# EAGLE design main (EAGLE 8.6.0)

## Sheet 1 of 7
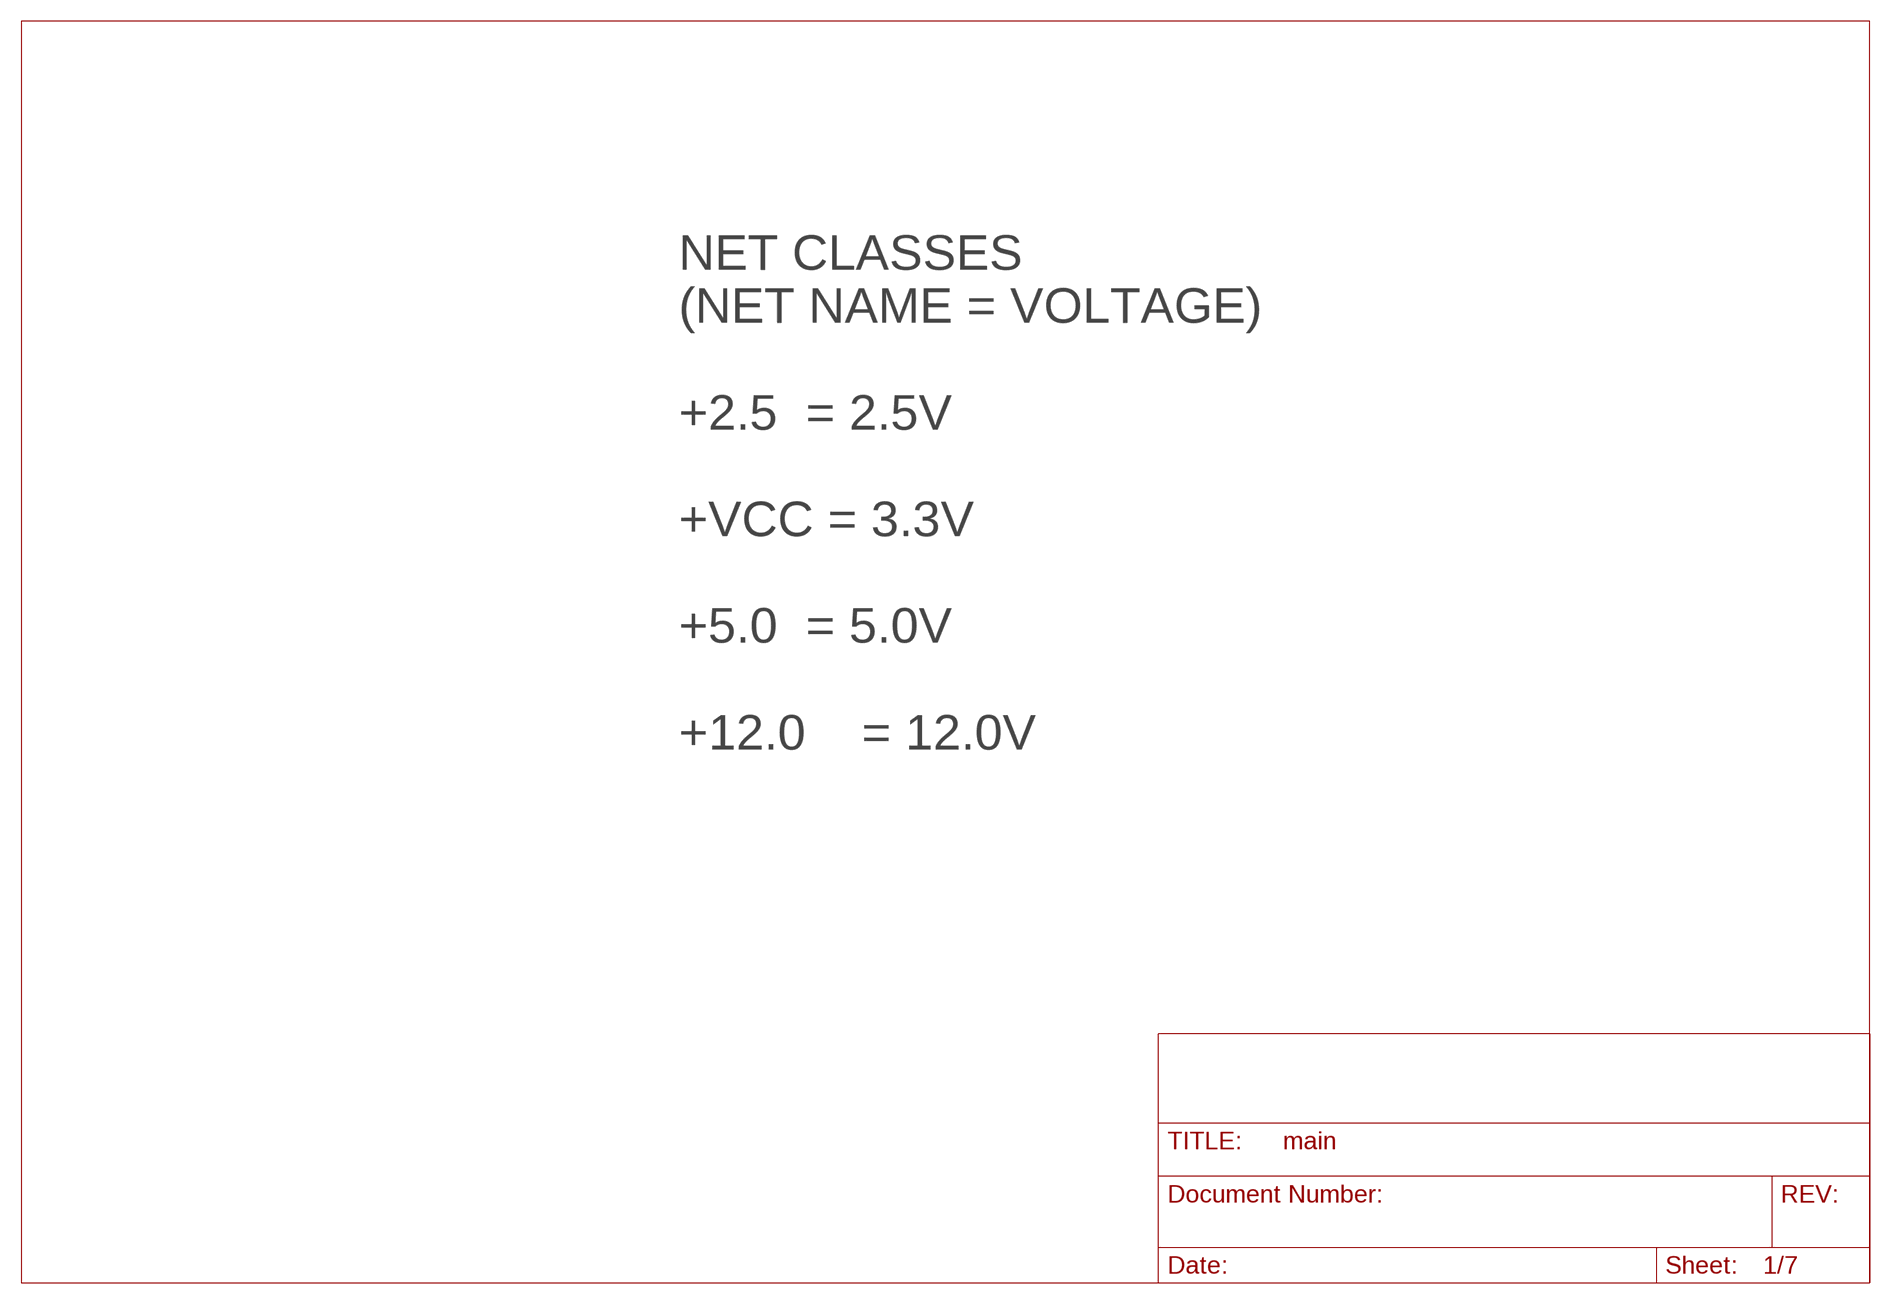
[diagram p0: schematic, sheet 1]

### Notes on the sheet
- NET CLASSES
  (NET NAME = VOLTAGE)
  
  +2.5  = 2.5V
  
  +VCC = 3.3V
  
  +5.0  = 5.0V
  
  +12.0    = 12.0V

## Sheet 2 of 7: MCU
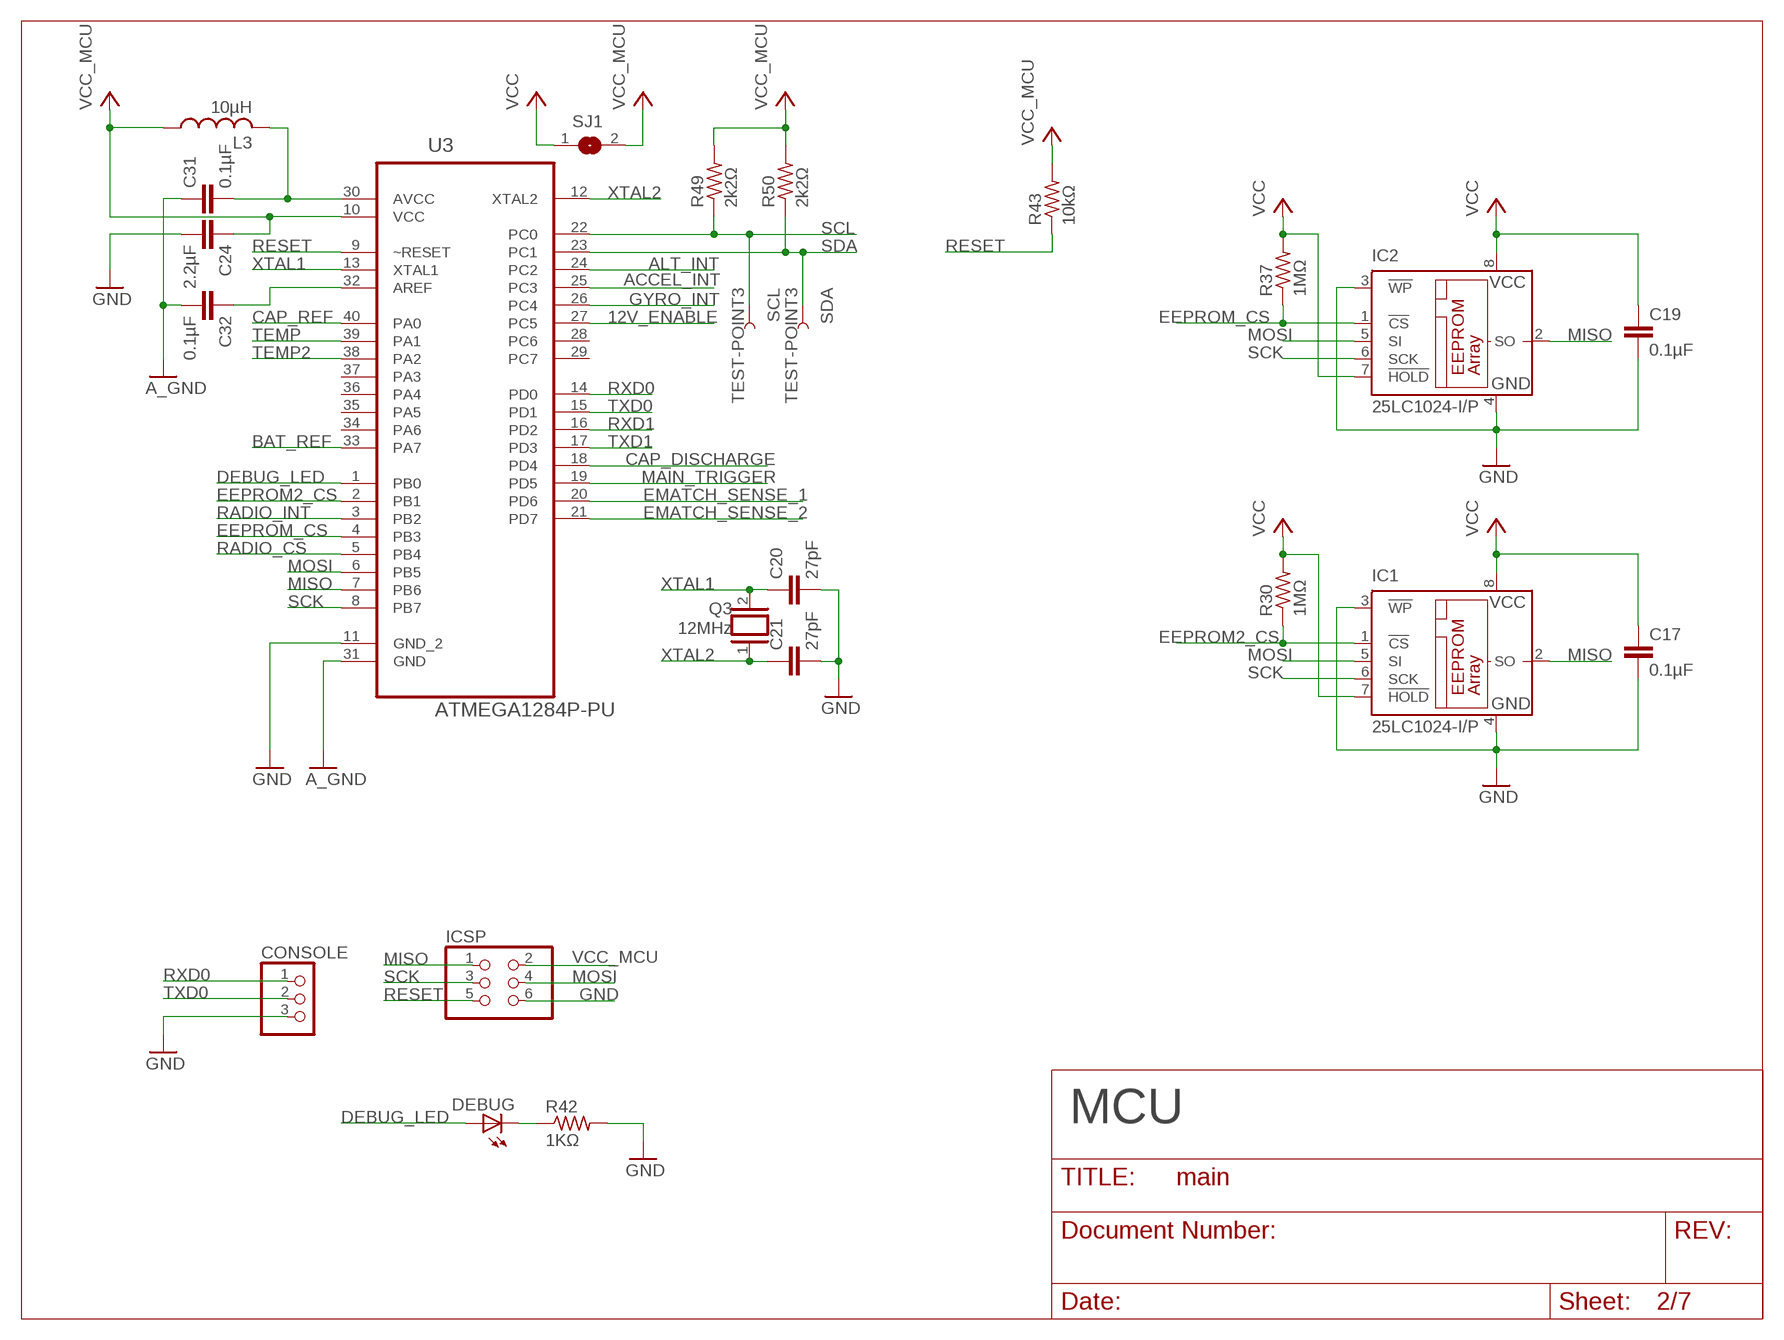
[diagram p1: schematic, sheet 2]

### Parts
C17  0.1µF  C-EU025-025X050  [C025-025X050]
C19  0.1µF  C-EU025-025X050  [C025-025X050]
C20  27pF  C-EU025-025X050  [C025-025X050]
C21  27pF  C-EU025-025X050  [C025-025X050]
C24  2.2µF  C-EU025-025X050  [C025-025X050]
C31  0.1µF  C-EU025-025X050  [C025-025X050]
C32  0.1µF  C-EU025-025X050  [C025-025X050]
CONSOLE  PINHD-1X3  [1X03]
DEBUG  LED5MM  [LED5MM]
IC1  25LC1024-I/P  25LC080P  [DIL8]
IC2  25LC1024-I/P  25LC080P  [DIL8]
ICSP  PINHD-2X3  [2X03]
L3  10µH  L-US0207/5V  [0207/5V]
Q3  12MHz  XTAL/S  [QS]
R30  1MΩ  R-US_0207/5V  [0207/5V]
R37  1MΩ  R-US_0207/5V  [0207/5V]
R42  1KΩ  R-US_0207/5V  [0207/5V]
R43  10kΩ  R-US_0207/5V  [0207/5V]
R49  2k2Ω  R-US_0207/5V  [0207/5V]
R50  2k2Ω  R-US_0207/5V  [0207/5V]
SCL  TEST-POINT3  [PAD.03X.03]
SDA  TEST-POINT3  [PAD.03X.03]
SJ1  SJ  [SJ]
U3  ATMEGA1284P-PU  [DIP254P1524X483-40]

### Nets
12V_ENABLE: U3.27(PC5) ; also sheet 5,7
A_GND: C31.1 C32.2 U3.31(GND) ; also sheet 3,7
ACCEL_INT: U3.25(PC3) ; also sheet 3
ALT_INT: U3.24(PC2) ; also sheet 3
AREF: C32.1 U3.32(AREF)
AVCC: C31.2 L3.2 U3.30(AVCC) ; also sheet 3
BAT_REF: U3.33(PA7) ; also sheet 3
CAP_DISCHARGE: U3.18(PD4) ; also sheet 7
CAP_REF: U3.40(PA0) ; also sheet 7
DEBUG_LED: DEBUG.A U3.1(PB0)
EEPROM2_CS: IC1.1(!CS) R30.1 U3.2(PB1)
EEPROM_CS: IC2.1(!CS) R37.1 U3.4(PB3)
EMATCH_SENSE_1: U3.20(PD6) ; also sheet 7
EMATCH_SENSE_2: U3.21(PD7) ; also sheet 7
GND: C17.2 C19.2 C20.2 C21.2 C24.2 CONSOLE.3 IC1.3(!WP) IC1.4(GND) IC2.3(!WP) IC2.4(GND) ICSP.6 R42.2 U3.11(GND_2) ; also sheet 3,4,5,6,7
GYRO_INT: U3.26(PC4) ; also sheet 3
MAIN_TRIGGER: U3.19(PD5) ; also sheet 7
MISO: IC1.2(SO) IC2.2(SO) ICSP.1 U3.7(PB6) ; also sheet 4
MOSI: IC1.5(SI) IC2.5(SI) ICSP.4 U3.6(PB5) ; also sheet 4
N$71: DEBUG.K(C) R42.1
RADIO_CS: U3.5(PB4) ; also sheet 4
RADIO_INT: U3.3(PB2) ; also sheet 4
RESET: ICSP.5 R43.1 U3.9(~RESET)
RXD0: CONSOLE.1 U3.14(PD0)
RXD1: U3.16(PD2) ; also sheet 3
SCK: IC1.6(SCK) IC2.6(SCK) ICSP.3 U3.8(PB7) ; also sheet 4
SCL: R49.1 SCL.P$1 U3.22(PC0) ; also sheet 3
SDA: R50.1 SDA.P$1 U3.23(PC1) ; also sheet 3
TEMP: U3.39(PA1) ; also sheet 3
TEMP2: U3.38(PA2) ; also sheet 3
TXD0: CONSOLE.2 U3.15(PD1)
TXD1: U3.17(PD3) ; also sheet 3
VCC: C17.1 C19.1 IC1.7(!HOLD) IC1.8(VCC) IC2.7(!HOLD) IC2.8(VCC) R30.2 R37.2 SJ1.1 ; also sheet 3,4,5
VCC_MCU: C24.1 ICSP.2 L3.1 R43.2 R49.2 R50.2 SJ1.2 U3.10(VCC) ; also sheet 4
XTAL1: C20.1 Q3.2 U3.13(XTAL1)
XTAL2: C21.1 Q3.1 U3.12(XTAL2)
Unconnected: U3.28(PC6) U3.29(PC7) U3.34(PA6) U3.35(PA5) U3.36(PA4) U3.37(PA3)

### Notes on the sheet
- MCU

## Sheet 3 of 7: SENSORS
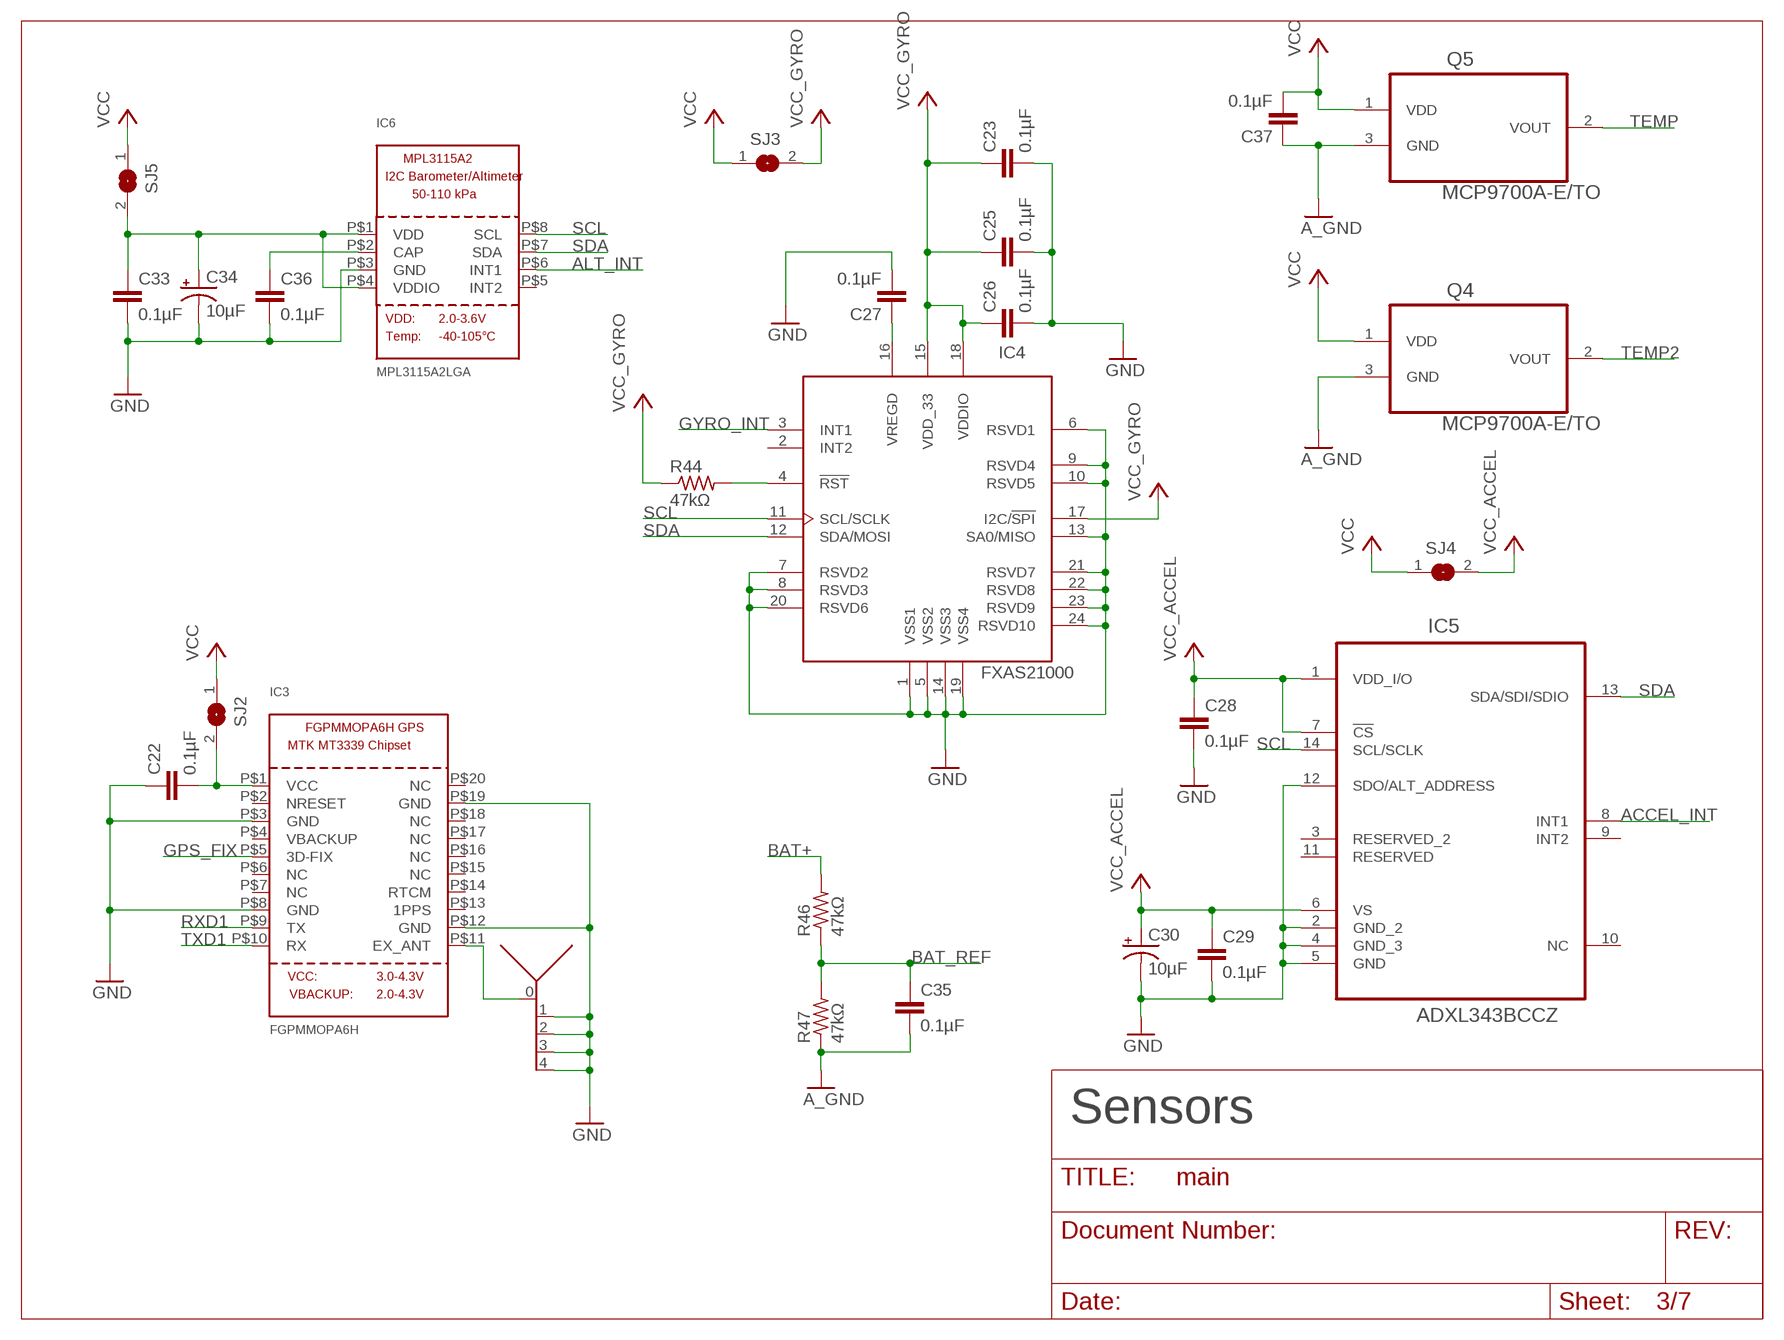
[diagram p2: schematic, sheet 3]

### Parts
C22  0.1µF  C-EU025-025X050  [C025-025X050]
C23  0.1µF  C-EU025-025X050  [C025-025X050]
C25  0.1µF  C-EU025-025X050  [C025-025X050]
C26  0.1µF  C-EU025-025X050  [C025-025X050]
C27  0.1µF  C-EU025-025X050  [C025-025X050]
C28  0.1µF  C-EU025-025X050  [C025-025X050]
C29  0.1µF  C-EU025-025X050  [C025-025X050]
C30  10µF  CPOL-USE2-5  [E2-5]
C33  0.1µF  C-EU025-025X050  [C025-025X050]
C34  10µF  CPOL-USE2-5  [E2-5]
C35  0.1µF  C-EU025-025X050  [C025-025X050]
C36  0.1µF  C-EU025-025X050  [C025-025X050]
C37  0.1µF  C-EU025-025X050  [C025-025X050]
IC3  FGPMMOPA6H  GPS_FGPMMOPA6H  [FGPMMOPA6H]
IC4  FXAS21000  [QFN24_0P5_4X4_ASYM_EXP]
IC5  ADXL343BCCZ  [LGA14R80P1X6_300X500X100]
IC6  MPL3115A2LGA  [LGA8]
Q4  MCP9700A-E/TO  [TO127P254X533-3]
Q5  MCP9700A-E/TO  [TO127P254X533-3]
R44  47kΩ  R-US_0207/5V  [0207/5V]
R46  47kΩ  R-US_0207/5V  [0207/5V]
R47  47kΩ  R-US_0207/5V  [0207/5V]
SJ2  SJ  [SJ]
SJ3  SJ  [SJ]
SJ4  SJ  [SJ]
SJ5  SJ  [SJ]
X1  132134RP  [132134RP]

### Nets
A_GND: C35.2 C37.1 Q4.3(GND) Q5.3(GND) R47.1 ; also sheet 2,7
ACCEL_INT: IC5.8(INT1) ; also sheet 2
ALT_INT: IC6.P$6(INT1) ; also sheet 2
AVCC: C37.2 Q4.1(VDD) Q5.1(VDD) ; supply symbol labelled VCC ; also sheet 2
BAT+: R46.2 ; also sheet 6
BAT_REF: C35.1 R46.1 R47.2 ; also sheet 2
GND: C22.1 C23.2 C25.2 C26.2 C27.2 C28.2 C29.2 C30.- C33.2 C34.- C36.2 IC3.P$3(GND) IC3.P$8(GND) IC3.P$12(GND) IC3.P$19(GND) IC4.1(VSS1) IC4.5(VSS2) IC4.6(RSVD1) IC4.7(RSVD2) IC4.8(RSVD3) IC4.9(RSVD4) IC4.10(RSVD5) IC4.13(SA0/MISO) IC4.14(VSS3) IC4.19(VSS4) IC4.20(RSVD6) IC4.21(RSVD7) IC4.22(RSVD8) IC4.23(RSVD9) IC4.24(RSVD10) IC5.2(GND_2) IC5.4(GND_3) IC5.5(GND) IC5.12(SDO/ALT_ADDRESS) IC6.P$3(GND) X1.1(GND) X1.2(GND) X1.3(GND) X1.4(GND) ; also sheet 2,4,5,6,7
GPS_FIX: IC3.P$5(3D-FIX)
GYRO_INT: IC4.3(INT1) ; also sheet 2
N$1: C27.1 IC4.16(VREGD)
N$2: IC4.4(!RST) R44.2
N$3: C36.1 IC6.P$2(CAP)
N$4: IC3.P$11(EX_ANT) X1.0(ANTENNA)
RXD1: IC3.P$9(TX) ; also sheet 2
SCL: IC4.11(SCL/SCLK) IC5.14(SCL/SCLK) IC6.P$8(SCL) ; also sheet 2
SDA: IC4.12(SDA/MOSI) IC5.13(SDA/SDI/SDIO) IC6.P$7(SDA) ; also sheet 2
TEMP: Q5.2(VOUT) ; also sheet 2
TEMP2: Q4.2(VOUT) ; also sheet 2
TXD1: IC3.P$10(RX) ; also sheet 2
VCC: SJ2.1 SJ3.1 SJ4.1 SJ5.1 ; also sheet 2,4,5
VCC_ACCEL: C28.1 C29.1 C30.+ IC5.1(VDD_I/O) IC5.6(VS) IC5.7(!CS) SJ4.2
VCC_ALT: C33.1 C34.+ IC6.P$1(VDD) IC6.P$4(VDDIO) SJ5.2
VCC_GPS: C22.2 IC3.P$1(VCC) SJ2.2
VCC_GYRO: C23.1 C25.1 C26.1 IC4.15(VDD_33) IC4.17(I2C/!SPI) IC4.18(VDDIO) R44.1 SJ3.2
Unconnected: IC3.P$2(NRESET) IC3.P$4(VBACKUP) IC3.P$6(NC) IC3.P$7(NC) IC3.P$13(1PPS) IC3.P$14(RTCM) IC3.P$15(NC) IC3.P$16(NC) IC3.P$17(NC) IC3.P$18(NC) IC3.P$20(NC) IC4.2(INT2) IC5.3(RESERVED_2) IC5.9(INT2) IC5.10(NC) IC5.11(RESERVED) IC6.P$5(INT2)

### Notes on the sheet
- Sensors

## Sheet 4 of 7: RADIO
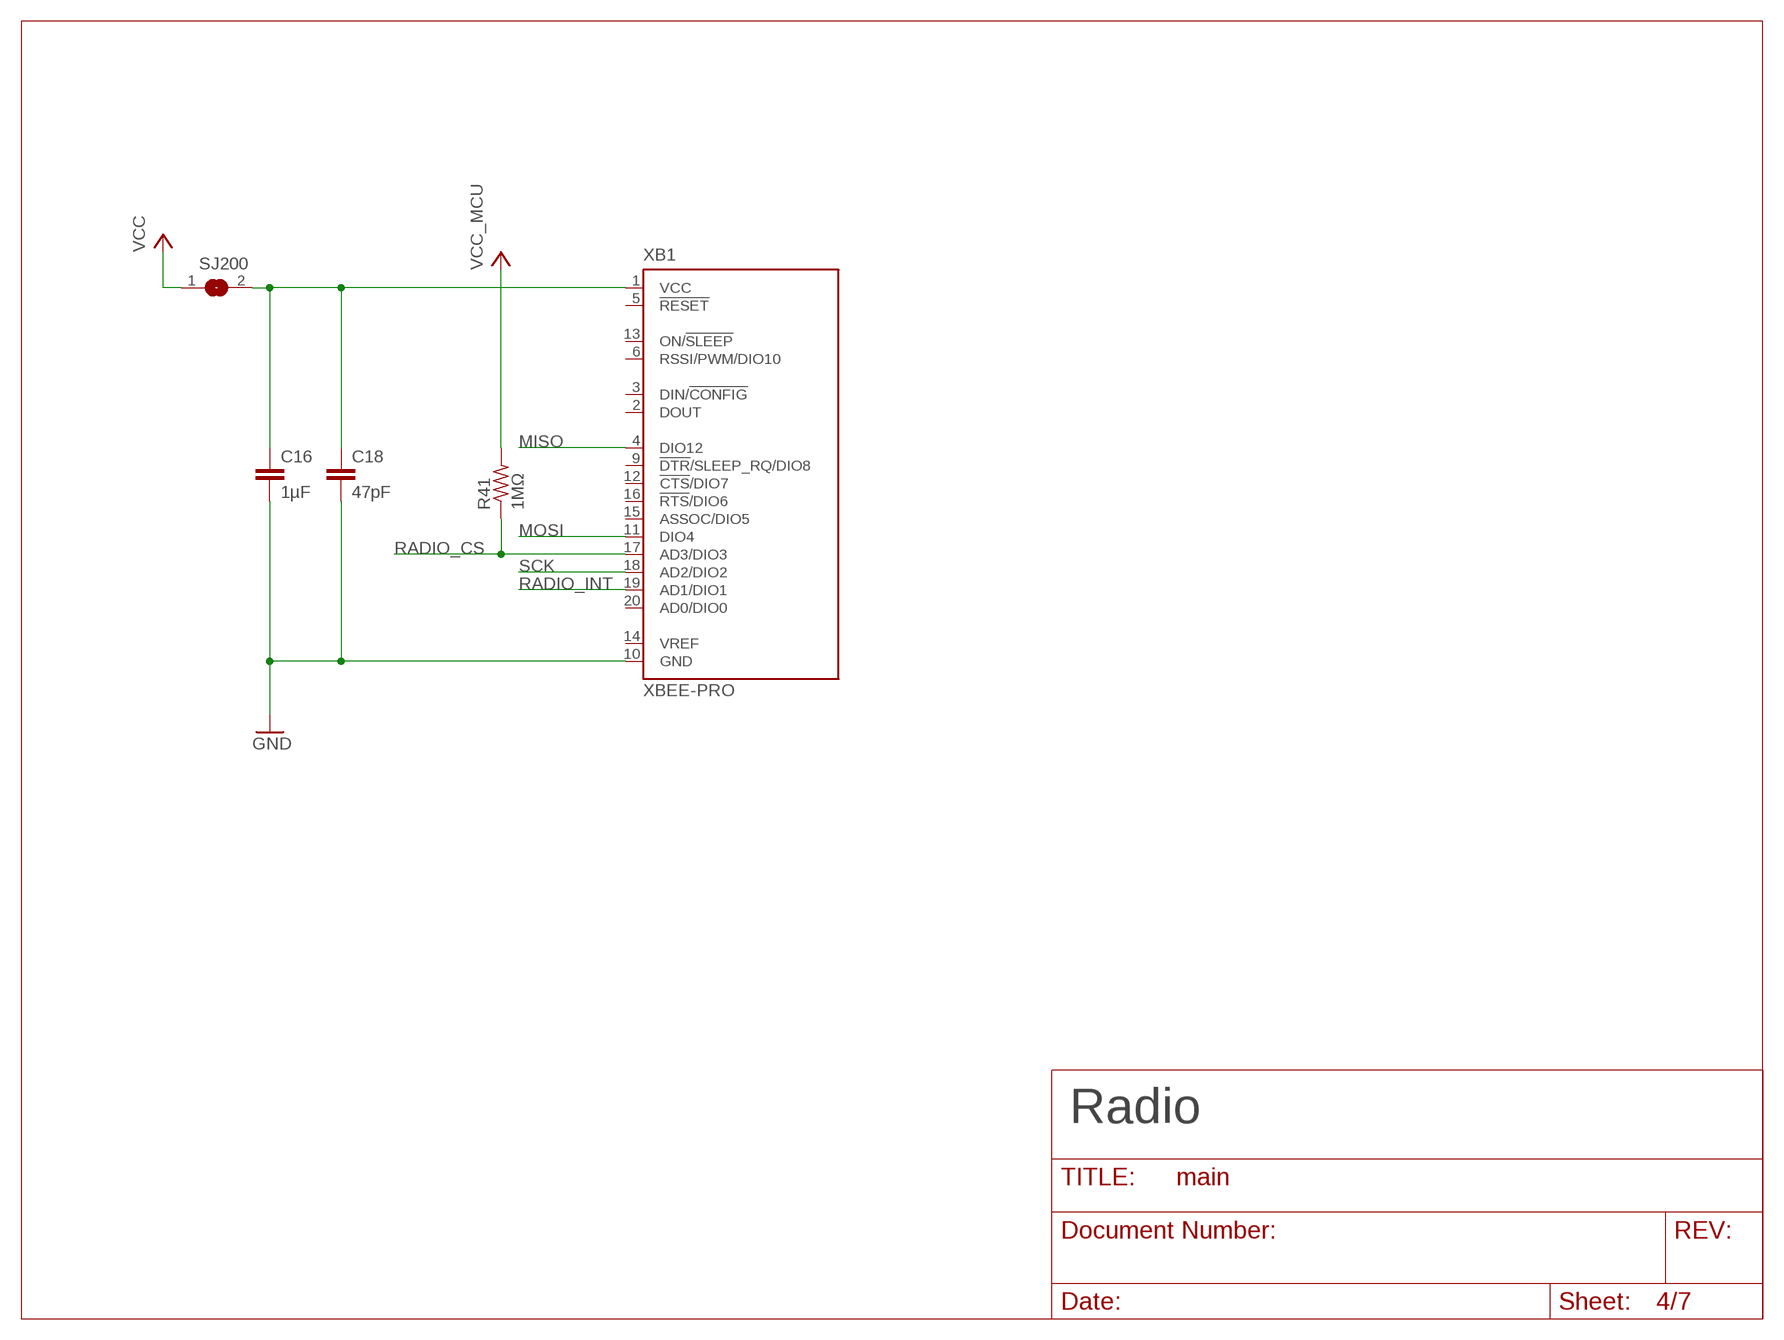
[diagram p3: schematic, sheet 4]

### Parts
C16  1µF  C-EU025-025X050  [C025-025X050]
C18  47pF  C-EU025-025X050  [C025-025X050]
R41  1MΩ  R-US_0207/5V  [0207/5V]
SJ200  SJ  [SJ]
XB1  XBEE-PRO  [XBEE-PRO]

### Nets
GND: C16.2 C18.2 XB1.10(GND) ; also sheet 2,3,5,6,7
MISO: XB1.4(DIO12) ; also sheet 2
MOSI: XB1.11(DIO4) ; also sheet 2
RADIO_CS: R41.1 XB1.17(AD3/DIO3) ; also sheet 2
RADIO_INT: XB1.19(AD1/DIO1) ; also sheet 2
SCK: XB1.18(AD2/DIO2) ; also sheet 2
VCC: SJ200.1 ; also sheet 2,3,5
VCC_MCU: R41.2 ; also sheet 2
VCC_XB: C16.1 C18.1 SJ200.2 XB1.1(VCC)
Unconnected: XB1.2(DOUT) XB1.3(DIN/!CONFIG) XB1.5(!RESET) XB1.6(RSSI/PWM/DIO10) XB1.9(!DTR!/SLEEP_RQ/DIO8) XB1.12(!CTS!/DIO7) XB1.13(ON/!SLEEP) XB1.14(VREF) XB1.15(ASSOC/DIO5) XB1.16(!RTS!/DIO6) XB1.20(AD0/DIO0)

### Notes on the sheet
- Radio

## Sheet 5 of 7: Power Regulatror
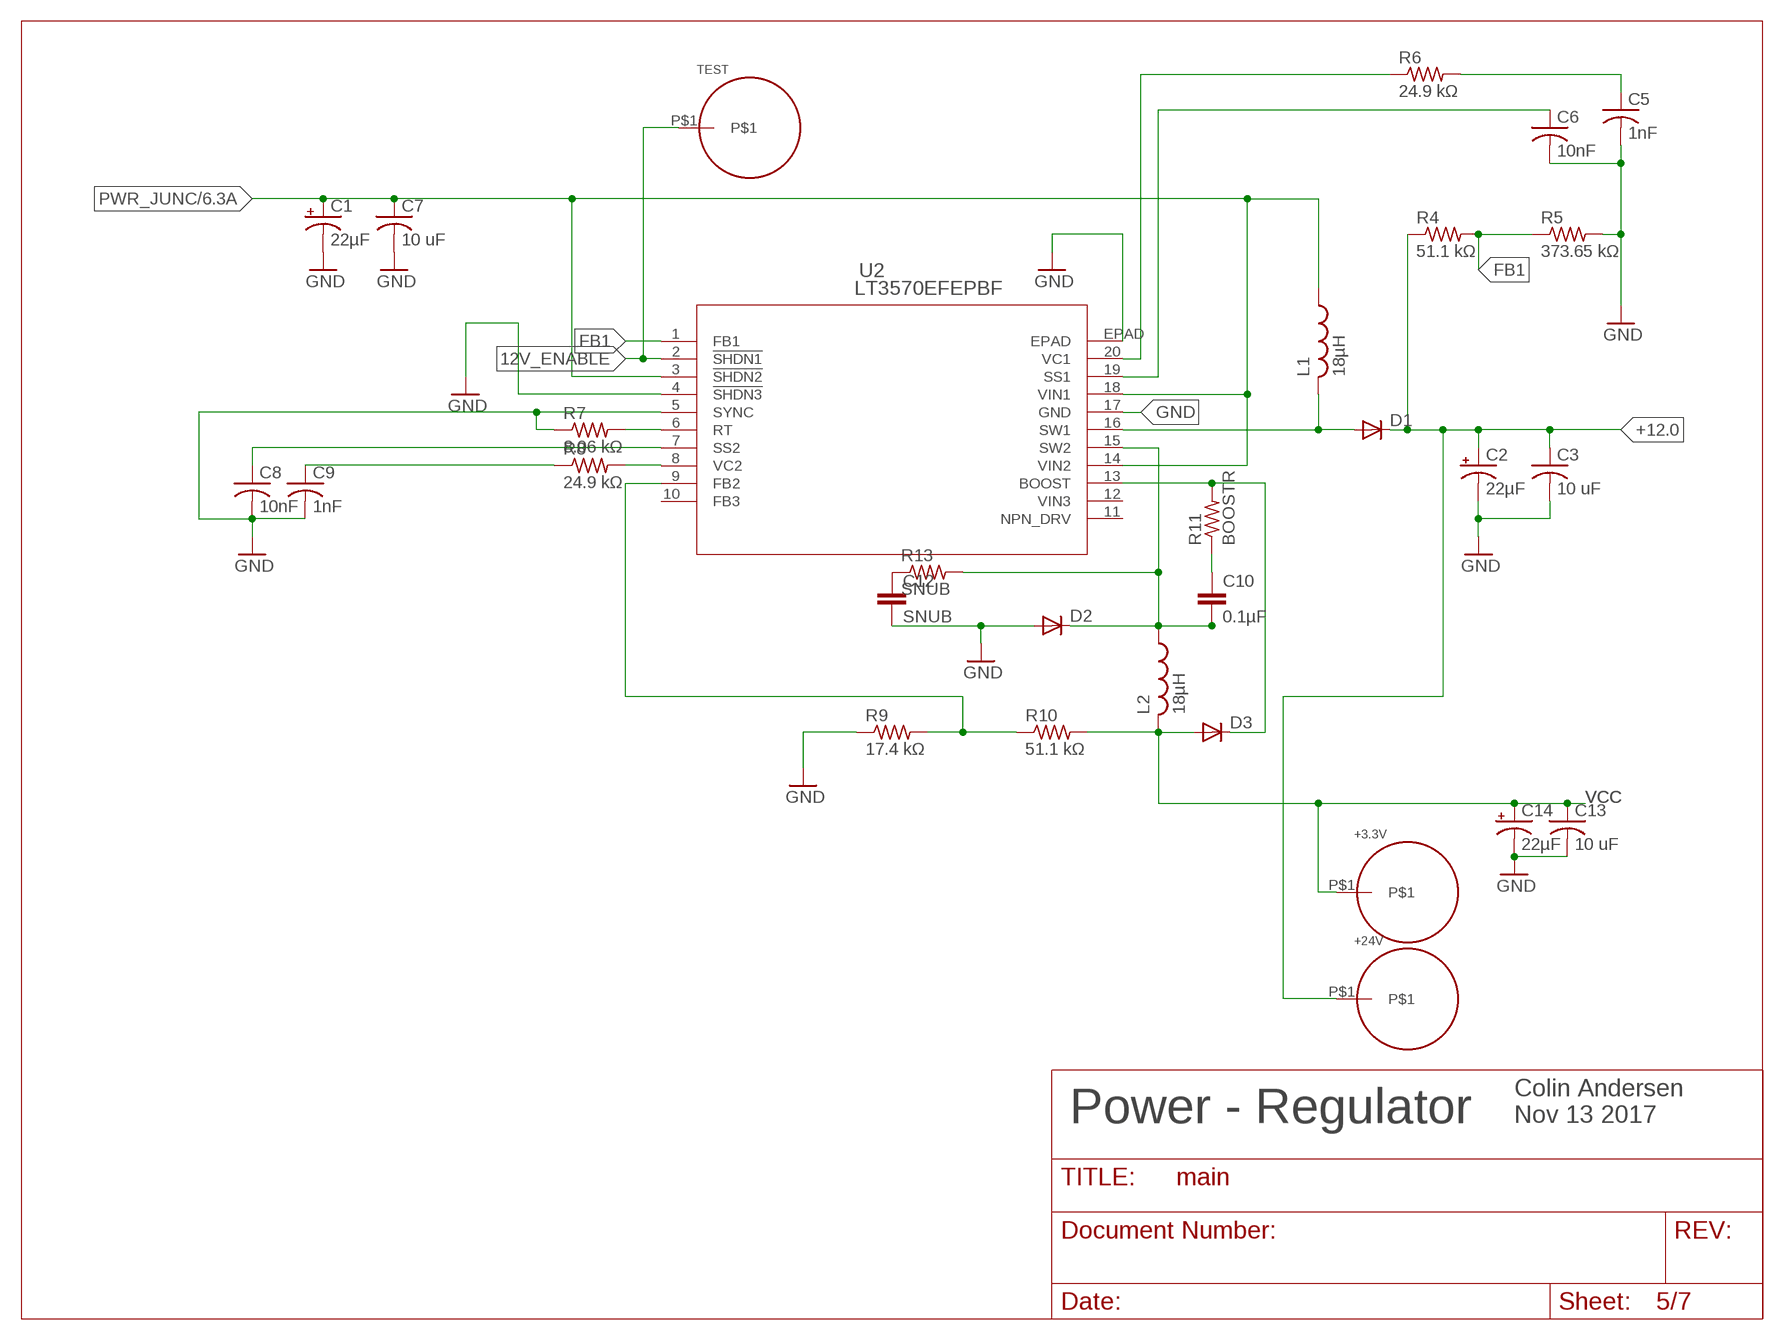
[diagram p4: schematic, sheet 5]

### Parts
C1  22µF  UST1V220MDD  [2.5MM_AL_CAP]
C2  22µF  UST1V220MDD  [2.5MM_AL_CAP]
C3  10 uF  K102K15X7RF5TL2  [2.5MM_CAP]
C5  1nF  K102K15X7RF5TL2  [2.5MM_CAP]
C6  10nF  K103K15X7RF5TL2  [2.5MM_CAP]
C7  10 uF  K102K15X7RF5TL2  [2.5MM_CAP]
C8  10nF  K103K15X7RF5TL2  [2.5MM_CAP]
C9  1nF  K102K15X7RF5TL2  [2.5MM_CAP]
C10  0.1µF  C-EU025-025X050  [C025-025X050]
C12  SNUB  C-EU025-025X050  [C025-025X050]
C13  10 uF  K102K15X7RF5TL2  [2.5MM_CAP]
C14  22µF  UST1V220MDD  [2.5MM_AL_CAP]
D1  SB230TA  [11.6MM_D]
D2  SB230TA  [11.6MM_D]
D3  SB230TA  [11.6MM_D]
L1  18µH  RLB0914-180KL  [5.4MM_L]
L2  18µH  RLB0914-180KL  [5.4MM_L]
R4  51.1 kΩ  R-US_0207/5V  [0207/5V]
R5  373.65 kΩ  R-US_0207/5V  [0207/5V]
R6  24.9 kΩ  R-US_0207/5V  [0207/5V]
R7  8.06 kΩ  R-US_0207/5V  [0207/5V]
R8  24.9 kΩ  R-US_0207/5V  [0207/5V]
R9  17.4 kΩ  R-US_0207/5V  [0207/5V]
R10  51.1 kΩ  R-US_0207/5V  [0207/5V]
R11  BOOSTR  R-US_0207/5V  [0207/5V]
R13  SNUB  R-US_0207/5V  [0207/5V]
U2  LT3570EFEPBF  [TSSOP-20_FE/CB]
U$2  +24V  TEST  [TEST]
U$3  +3.3V  TEST  [TEST]
U$5  TEST  [TEST]

### Nets
12V_ENABLE: U2.2(!SHDN1) U$5.P$1 ; also sheet 2,7
+12.0: C2.1(+) C3.1 D1.1(C) R4.1 U$2.P$1 ; also sheet 7
FB1: R4.2 R5.1 U2.1(FB1)
GND: C1.2(-) C2.2(-) C3.2 C5.2 C6.2 C7.2 C8.2 C9.2 C12.2 C13.2 C14.2(-) D2.2(A) R5.2 R7.1 R9.1 U2.4(!SHDN3) U2.5(SYNC) U2.17(GND) U2.EPAD ; also sheet 2,3,4,6,7
N$5: C8.1 U2.7(SS2)
N$6: R7.2 U2.6(RT)
N$7: R8.2 U2.8(VC2)
N$8: D1.2(A) L1.2 U2.16(SW1)
N$9: C5.1 R6.2
N$10: C9.1 R8.1
N$11: R6.1 U2.20(VC1)
N$12: C6.1 U2.19(SS1)
N$13: C10.2 D2.1(C) L2.1 R13.2 U2.15(SW2)
N$15: R9.2 R10.1 U2.9(FB2)
N$16: D3.1(C) R11.2 U2.13(BOOST)
N$67: C12.1 R13.1
N$75: C10.1 R11.1
PWR_JUNC: C1.1(+) C7.1 L1.1 U2.3(!SHDN2) U2.14(VIN2) U2.18(VIN1) ; also sheet 6
VCC: C13.1 C14.1(+) D3.2(A) L2.2 R10.2 U$3.P$1 ; also sheet 2,3,4
Unconnected: U2.10(FB3) U2.11(NPN_DRV) U2.12(VIN3)

### Notes on the sheet
- Power - Regulator
- Colin Andersen
  Nov 13 2017

## Sheet 6 of 7: Battery Voltage cutoff circuit
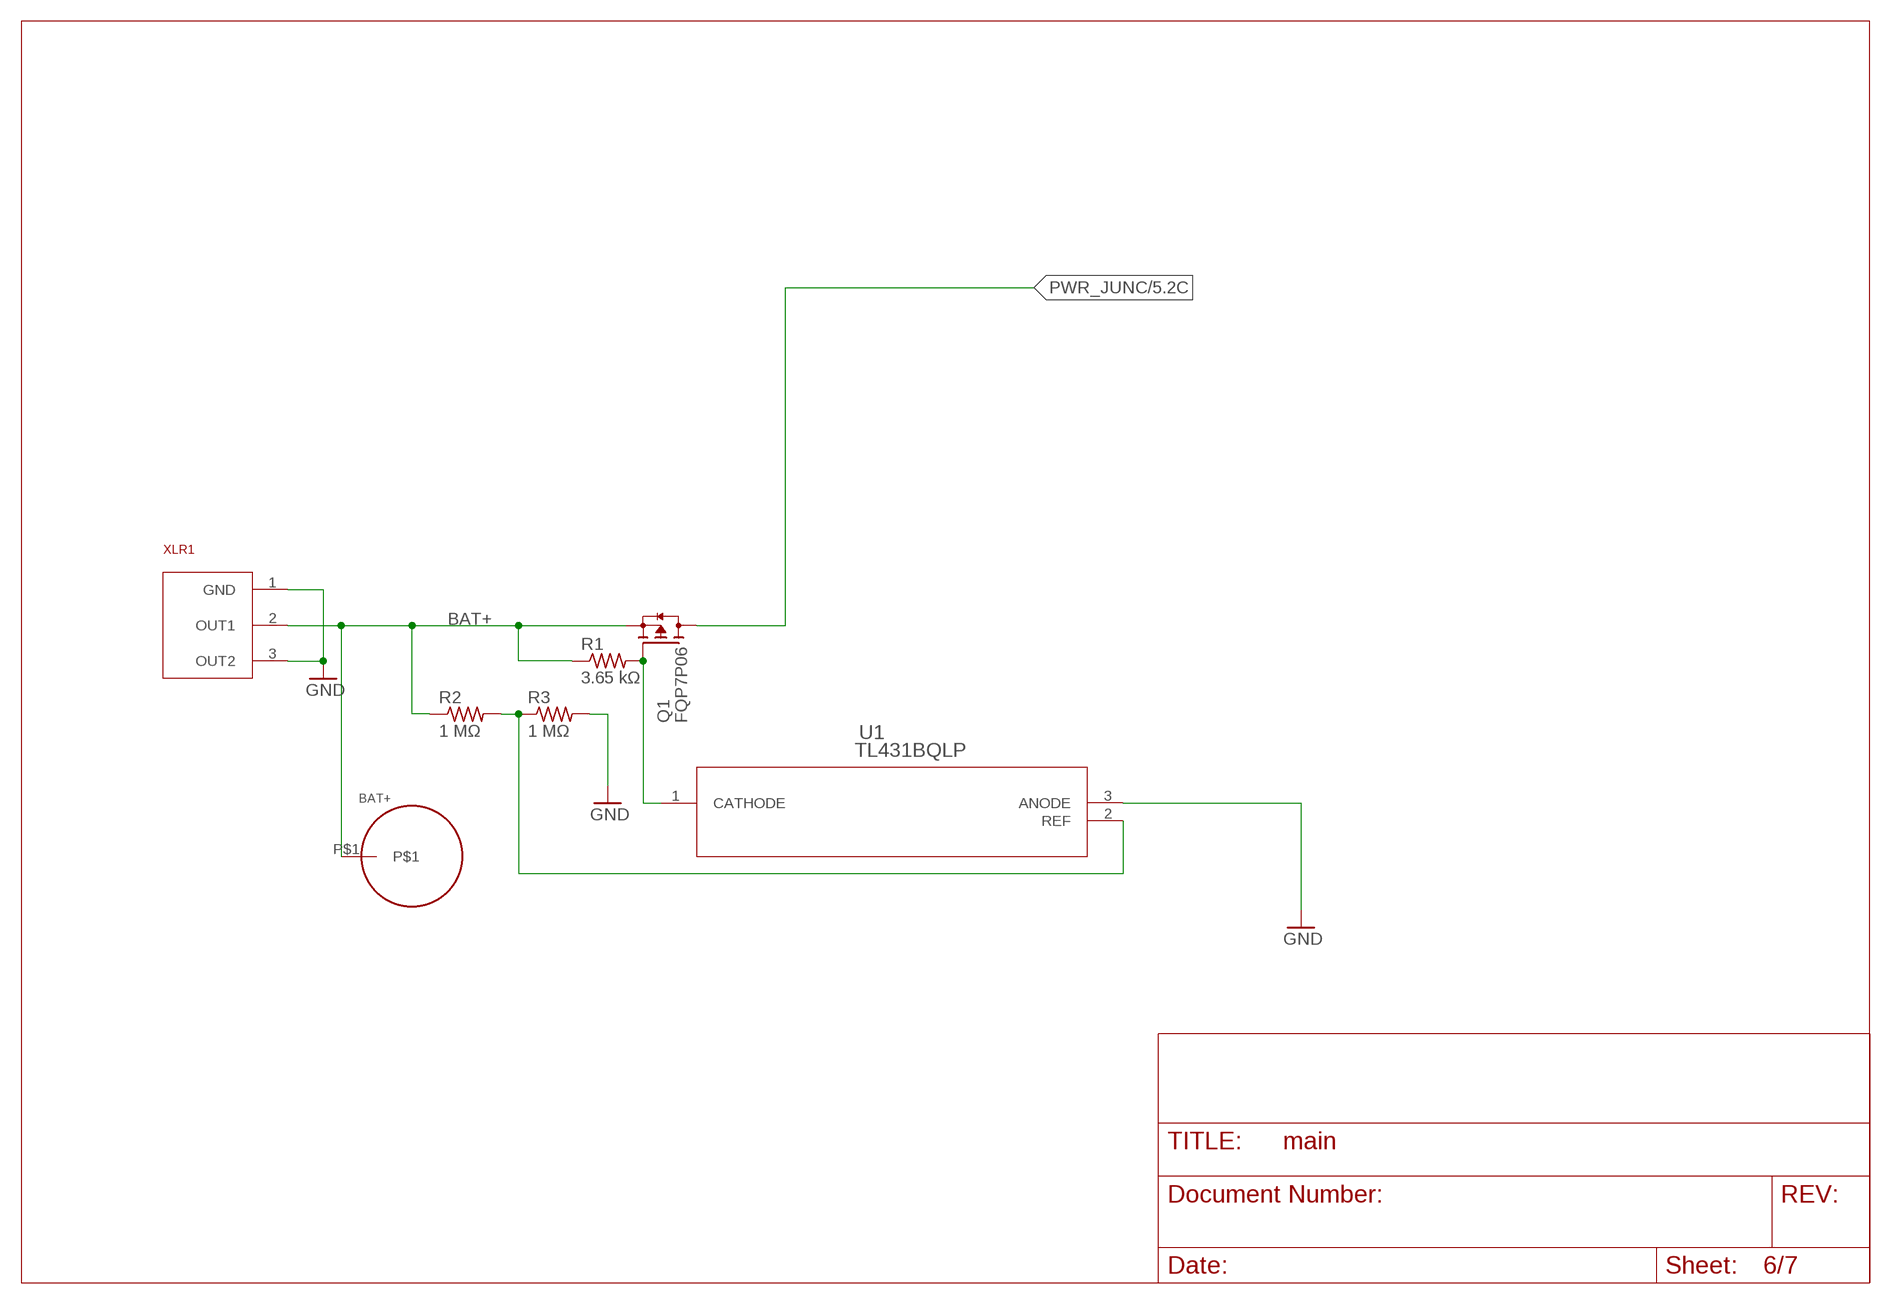
[diagram p5: schematic, sheet 6]

### Parts
Q1  FQP7P06  [PMOS]
R1  3.65 kΩ  R-US_0207/5V  [0207/5V]
R2  1 MΩ  R-US_0207/5V  [0207/5V]
R3  1 MΩ  R-US_0207/5V  [0207/5V]
U1  TL431BQLP  [LP3]
U$1  BAT+  TEST  [TEST]
XLR1  NC3FAH1  [NC3FAH1]

### Nets
BAT+: Q1.3(S) R1.1 R2.1 U$1.P$1 XLR1.2(OUT1) ; also sheet 3
GND: R3.2 U1.3(ANODE) XLR1.1(GND) XLR1.3(OUT2) ; also sheet 2,3,4,5,7
N$69: Q1.1(G) R1.2 U1.1(CATHODE)
N$70: R2.2 R3.1 U1.2(REF)
PWR_JUNC: Q1.2(D) ; also sheet 5

## Sheet 7 of 7: Capictor bank and key switch
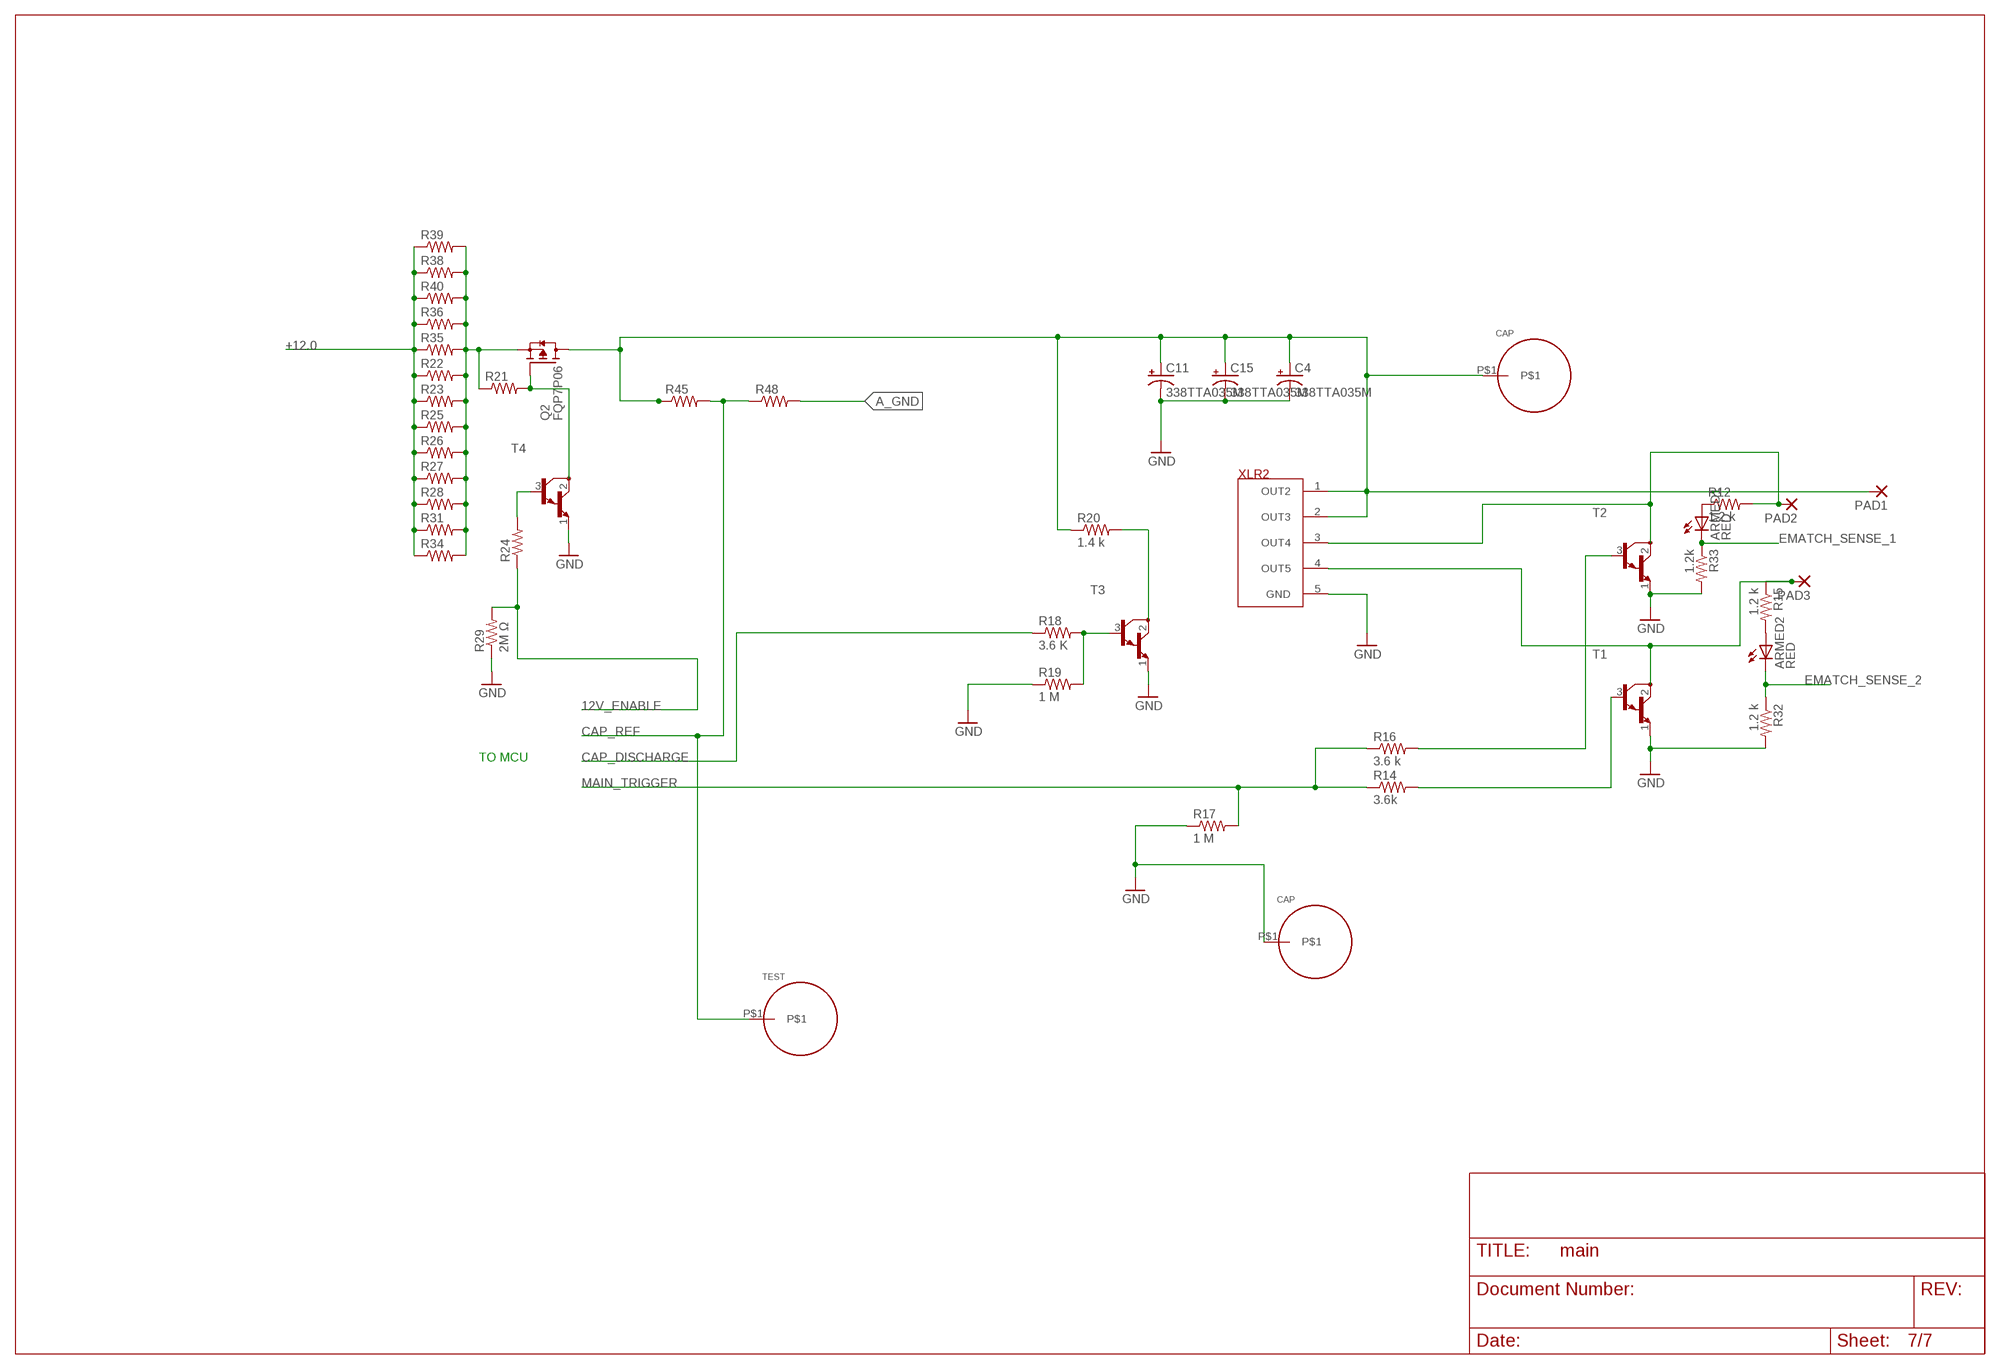
[diagram p6: schematic, sheet 7]

### Parts
ARMED1  RED  LED5MM  [LED5MM]
ARMED2  RED  LED5MM  [LED5MM]
C4  338TTA035M  [338TTA035M]
C11  338TTA035M  [338TTA035M]
C15  338TTA035M  [338TTA035M]
PAD1  CRIMP  [3,81/1,4]
PAD2  CRIMP  [3,81/1,4]
PAD3  CRIMP  [3,81/1,4]
Q2  FQP7P06  [PMOS]
R12  1.2 k  R-US_0207/5V  [0207/5V]
R14  3.6k  R-US_0207/5V  [0207/5V]
R15  1.2 k  R-US_0207/5V  [0207/5V]
R16  3.6 k  R-US_0207/5V  [0207/5V]
R17  1 M  R-US_0207/5V  [0207/5V]
R18  3.6 K  R-US_0207/5V  [0207/5V]
R19  1 M  R-US_0207/5V  [0207/5V]
R20  1.4 k  R-US_0207/5V  [0207/5V]
R21  R-US_0207/5V  [0207/5V]
R22  R-US_0207/5V  [0207/5V]
R23  R-US_0207/5V  [0207/5V]
R24  R-US_0207/5V  [0207/5V]
R25  R-US_0207/5V  [0207/5V]
R26  R-US_0207/5V  [0207/5V]
R27  R-US_0207/5V  [0207/5V]
R28  R-US_0207/5V  [0207/5V]
R29  2M Ω  R-US_0207/5V  [0207/5V]
R31  R-US_0207/5V  [0207/5V]
R32  1.2 k  R-US_0207/5V  [0207/5V]
R33  1.2k  R-US_0207/5V  [0207/5V]
R34  R-US_0207/5V  [0207/5V]
R35  R-US_0207/5V  [0207/5V]
R36  R-US_0207/5V  [0207/5V]
R38  R-US_0207/5V  [0207/5V]
R39  R-US_0207/5V  [0207/5V]
R40  R-US_0207/5V  [0207/5V]
R45  R-US_0207/5V  [0207/5V]
R48  R-US_0207/5V  [0207/5V]
T1  -NPN_DARL-  [NPNDARL]
T2  -NPN_DARL-  [NPNDARL]
T3  -NPN_DARL-  [NPNDARL]
T4  -NPN_DARL-  [NPNDARL]
U$4  CAP  TEST  [TEST]
U$6  CAP  TEST  [TEST]
U$7  TEST  [TEST]
XLR2  NC5FAH  [NC5FAH]

### Nets
12V_ENABLE: R24.1 R29.2 ; also sheet 2,5
+12.0: R22.1 R23.1 R25.1 R26.1 R27.1 R28.1 R31.1 R34.1 R35.1 R36.1 R38.1 R39.1 R40.1 ; also sheet 5
A_GND: R48.2 ; also sheet 2,3
CAP_DISCHARGE: R18.1 ; also sheet 2
CAP_REF: R45.2 R48.1 U$7.P$1 ; also sheet 2
EMATCH_SENSE_1: ARMED1.K(C) R33.1 ; also sheet 2
EMATCH_SENSE_2: ARMED2.K(C) R32.1 ; also sheet 2
GND: C4.- C11.- C15.- R17.1 R19.1 R29.1 R32.2 R33.2 T1.1(E) T2.1(E) T3.1(E) T4.1(E) U$4.P$1 XLR2.5(GND) ; also sheet 2,3,4,5,6
MAIN_TRIGGER: R14.1 R16.1 R17.2 ; also sheet 2
N$30: Q2.3(S) R21.1 R22.2 R23.2 R25.2 R26.2 R27.2 R28.2 R31.2 R34.2 R35.2 R36.2 R38.2 R39.2 R40.2
N$31: Q2.1(G) R21.2 T4.2(C)
N$34: R20.2 T3.2(C)
N$35: R24.2 T4.3(B)
N$77: PAD3.1(P) R15.1 T1.2(C) XLR2.4(OUT5)
N$78: PAD2.1(P) R12.2 T2.2(C) XLR2.3(OUT4)
N$79: R16.2 T2.3(B)
N$80: R14.2 T1.3(B)
N$81: C4.+ C11.+ C15.+ PAD1.1(P) Q2.2(D) R20.1 R45.1 U$6.P$1 XLR2.1(OUT2) XLR2.2(OUT3)
N$82: R18.2 R19.2 T3.3(B)
N$84: ARMED2.A R15.2
N$85: ARMED1.A R12.1

### Notes on the sheet
- TO MCU

## Library data of the parts
ARMED1 ARMED2 DEBUG = led:LED: LED OSRAM: - CHIPLED LG R971, LG N971, LY N971, LG Q971, LY Q971, LO R971, LY R971 LH N974, LH R974 LS Q976, LO Q976, LY Q976 LO Q996 - Hyper CHIPLED LW Q18S LB Q993, LB Q99A, LB R99A - SideLED LS A670, LO A670, LY A670, LG A670, LP A670 LB A673, LV A673, LT A673, LW A673 LH A674 LY A675 LS A676, LA A676, LO A676, LY A676, LW A676 LS A679, LY A679, LG A679 - Hyper Micro SIDELED® LS Y876, LA Y876, LO Y876, LY Y876 LT Y87S - SmartLED LW L88C, LW L88S LB L89C, LB L89S, LG L890 LS L89K, LO L89K, LY L89K LS L896, LA L896, LO L896, LY L896 - TOPLED LS T670, LO T670, LY T670, LG T670, LP T670 LSG T670, LSP T670, LSY T670, LOP T670, LYG T670 LG T671, LOG T671, LSG T671 LB T673, LV T673, LT T673, LW T673 LH T674 LS T676, LA T676, LO T676, LY T676, LB T676, LH T676, LSB T676, LW T676 LB T67C, LV T67C, LT T67C, LS T67K, LO T67K, LY T67K, LW E67C LS E67B, LA E67B, LO E67B, LY E67B, LB E67C, LV E67C, LT E67C LW T67C LS T679, LY T679, LG T679 LS T770, LO T770, LY T770, LG T770, LP T770 LB T773, LV T773, LT T773, LW T773 LH T774 LS E675, LA E675, LY E675, LS T675 LS T776, LA T776, LO T776, LY T776, LB T776 LHGB T686 LT T68C, LB T68C - Hyper Mini TOPLED® LB M676 - Mini TOPLED Santana® LG M470 LS M47K, LO M47K, LY M47K Source: http://www.osram.convergy.de LUXEON: - LUMILED® LXK2-PW12-R00, LXK2-PW12-S00, LXK2-PW14-U00, LXK2-PW14-V00 LXK2-PM12-R00, LXK2-PM12-S00, LXK2-PM14-U00 LXK2-PE12-Q00, LXK2-PE12-R00, LXK2-PE12-S00, LXK2-PE14-T00, LXK2-PE14-U00 LXK2-PB12-K00, LXK2-PB12-L00, LXK2-PB12-M00, LXK2-PB14-N00, LXK2-PB14-P00, LXK2-PB14-Q00 LXK2-PR12-L00, LXK2-PR12-M00, LXK2-PR14-Q00, LXK2-PR14-R00 LXK2-PD12-Q00, LXK2-PD12-R00, LXK2-PD12-S00 LXK2-PH12-R00, LXK2-PH12-S00 LXK2-PL12-P00, LXK2-PL12-Q00, LXK2-PL12-R00 Source: www.luxeon.com KINGBRIGHT: KA-3528ASYC Source: www.kingbright.com
C1 C2 C14 = Power:UST1V220MDD: 22uF
C3 C5 C7 C9 C13 = Power:K102K15X7RF5TL2: 1nF
C4 C11 C15 = Power:338TTA035M
C6 C8 = Power:K103K15X7RF5TL2: 10nF
C10 C12 C16-C29 C31-C33 C35-C37 = rcl:C-EU: CAPACITOR, European symbol; SPICEPREFIX: C
C30 C34 = rcl:CPOL-US: POLARIZED CAPACITOR, American symbol; SPICEPREFIX: C
CONSOLE = pinhead:PINHD-1X3: PIN HEADER
D1-D3 = Power:SB230TA
IC1 IC2 = microchip:25*: Serial EEPROM 4K/ 8K , SPI bus; MF: MICROCHIP; MPN: 25LC080/P; OC_FARNELL: 1556143; OC_NEWARK: 92C7440
IC3 = microbuilder:GPS_FGPMMOPA6H: GPS Module - MTK MT3339 Chipset, -165dBm sensitivity, 22 channels, 10Hz, auto-select external antenna options
IC4 = Freescale_Sensors_v2:FXAS21000: Xtrinsic FXAS21000 3-Axis Rate Digital Gyroscope I2C and SPI interfaces 24-PIN QFN 4 mm x 4 mm x 1 mm CASE 2209-01
IC5 = CU in Space:ADXL343BCCZ: ACCELEROMETER, 3AXIS, 16G, 13BIT, 14LGA; MPN: ADXL343BCCZ; OC_FARNELL: 2191716; OC_NEWARK: 90T1358; PACKAGE: 14LGA; SUPPLIER: ANALOG DEVICES
IC6 = microbuilder:MPL3115A2
ICSP = pinhead:PINHD-2X3: PIN HEADER
L1 L2 = Power:RLB0914-180KL: 18uH
L3 = rcl:L-US: INDUCTOR, American symbol; SPICEPREFIX: L
PAD1-PAD3 = Power:CRIMP: THROUGH-HOLE PAD
Q1 Q2 = Power:FQP7P06: p-MOS
Q3 = special:XTAL/S: CRYSTAL
Q4 Q5 = CU in Space:MCP9700A-E/TO: THERMISTOR, LINEAR 10MV/C; MPN: MCP9700A-E/TO; OC_FARNELL: 1332164; OC_NEWARK: 17M0676; PACKAGE: TO-92-3; SUPPLIER: Microchip
R1-R50 = rcl:R-US_: RESISTOR, American symbol; SPICEPREFIX: R
SCL SDA = SparkFun-Connectors:TEST-POINT: SparkFun Test Points Bare copper test points for troubleshooting or In-Circuit-Testing. These are used by our Production team for verifying production board runs using pogo-pins on test beds. SparkFun Products: SparkFun LSM9DS1 Breakout <https://www.sparkfun.com/products/13284> SparkFun PSOC <https://www.sparkfun.com/products/13714> SparkFun Load Cell Amplifier <https://www.sparkfun.com/products/13879>
SJ1-SJ5 SJ200 = jumper:SJ: SMD solder JUMPER
T1-T4 = Power:*-NPN_DARL-: NPN Darlington Transistor
U1 = Power:TL431BQLP; MANUFACTURER_PART_NUMBER: TL431BQLP; VENDOR: Texas Instruments
U2 = Power:LT3570EFEPBF: Reglator; MANUFACTURER_PART_NUMBER: lt3570efe#pbf; VENDOR: Linear Technology
U3 = Atmel_By_element14_Batch_1-00:ATMEGA1284P-PU: 8-bit Microcontroller with In-System Programmable Flash; MPN: ATMEGA1284P-PU; OC_FARNELL: 1715481; OC_NEWARK: 15R0264; PACKAGE: PDIP-40; SUPPLIER: Atmel
U$1-U$7 = Power:TEST
X1 = CU in Space:132134RP: RPSMA Antenna Connector
XB1 = xbee:XBEE: XBee (TM) /XBee-PRO(TM) OEM RF Modules Source: MaxStream, Inc. xbee_productmanual.pdf; MPN: XBP24-AWI-001; OC_FARNELL: 1337916; OC_NEWARK: 42M2667
XLR1 = Power:NC3FAH1: 3 PIN XLR
XLR2 = Power:NC5FAH: 5 PIN XLR

## Net classes
0 default: clearance 0.205 mm

## Board
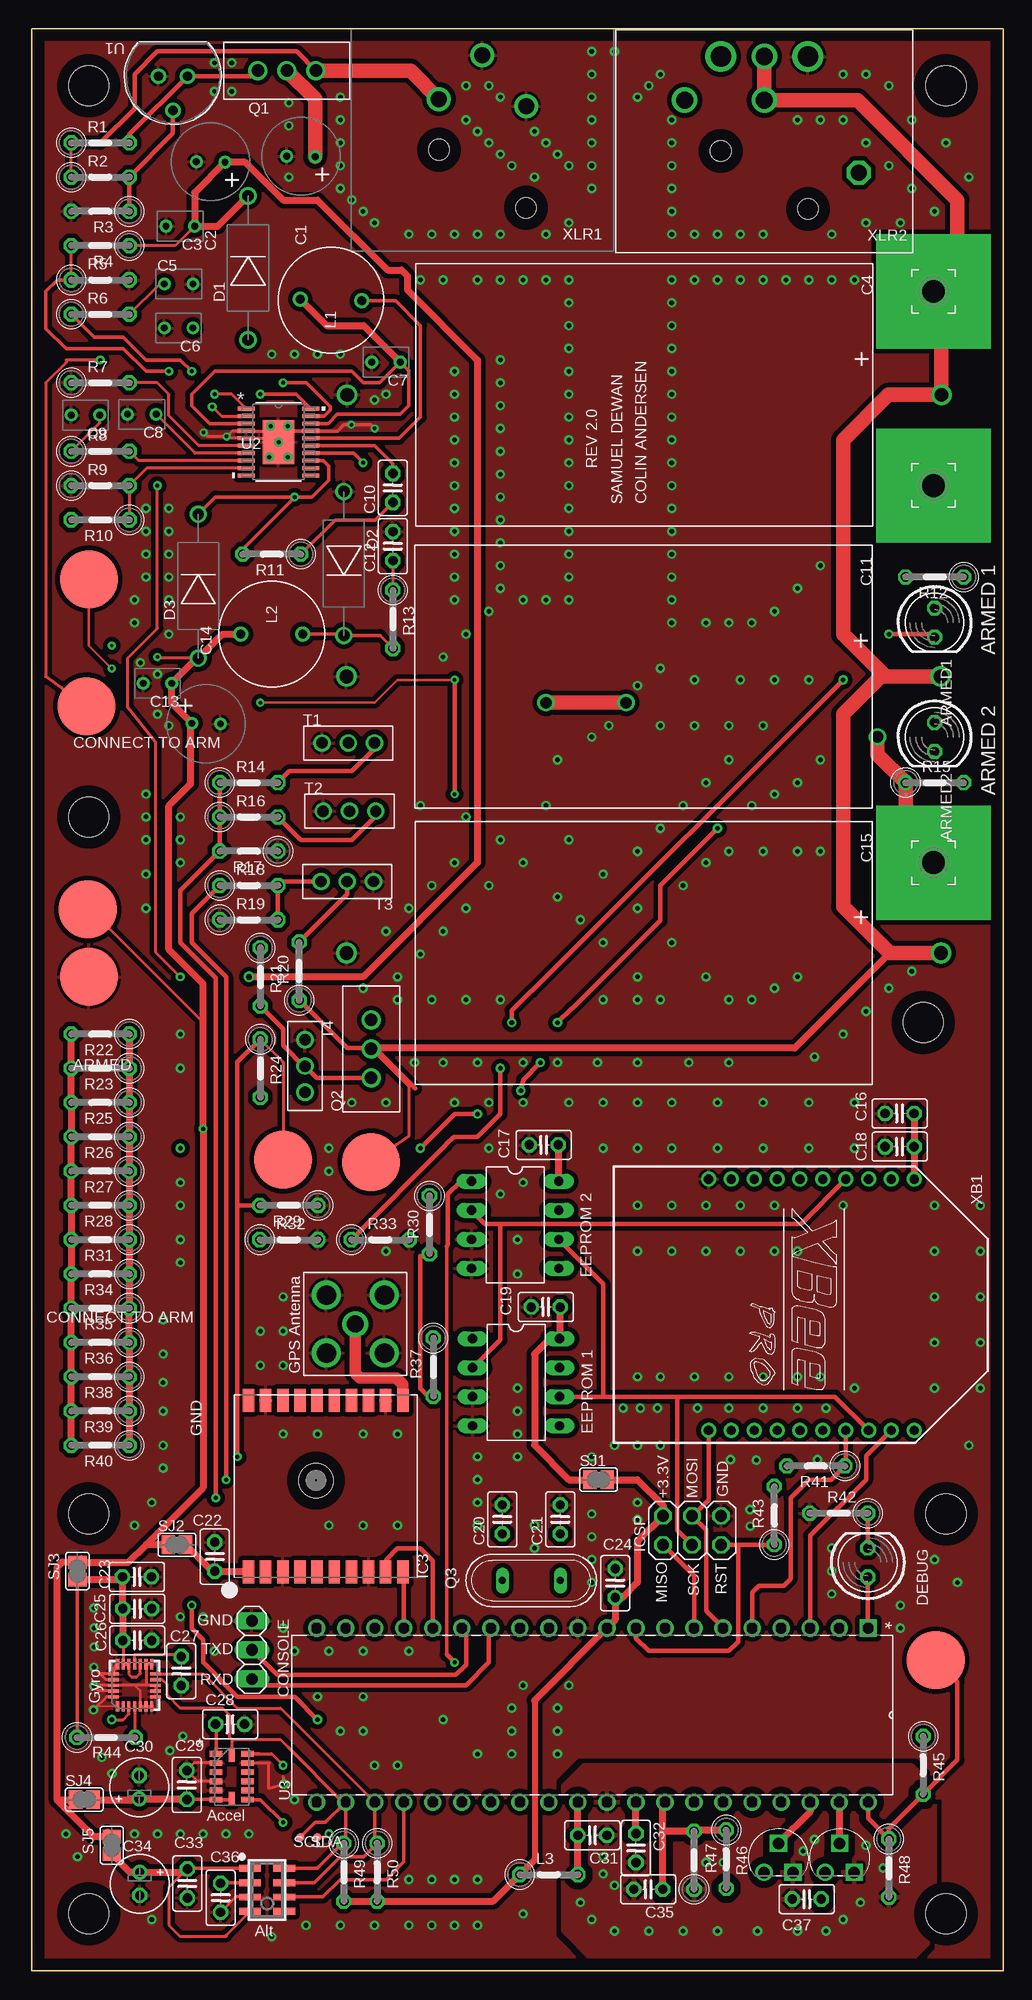
[diagram p7: board, top side]
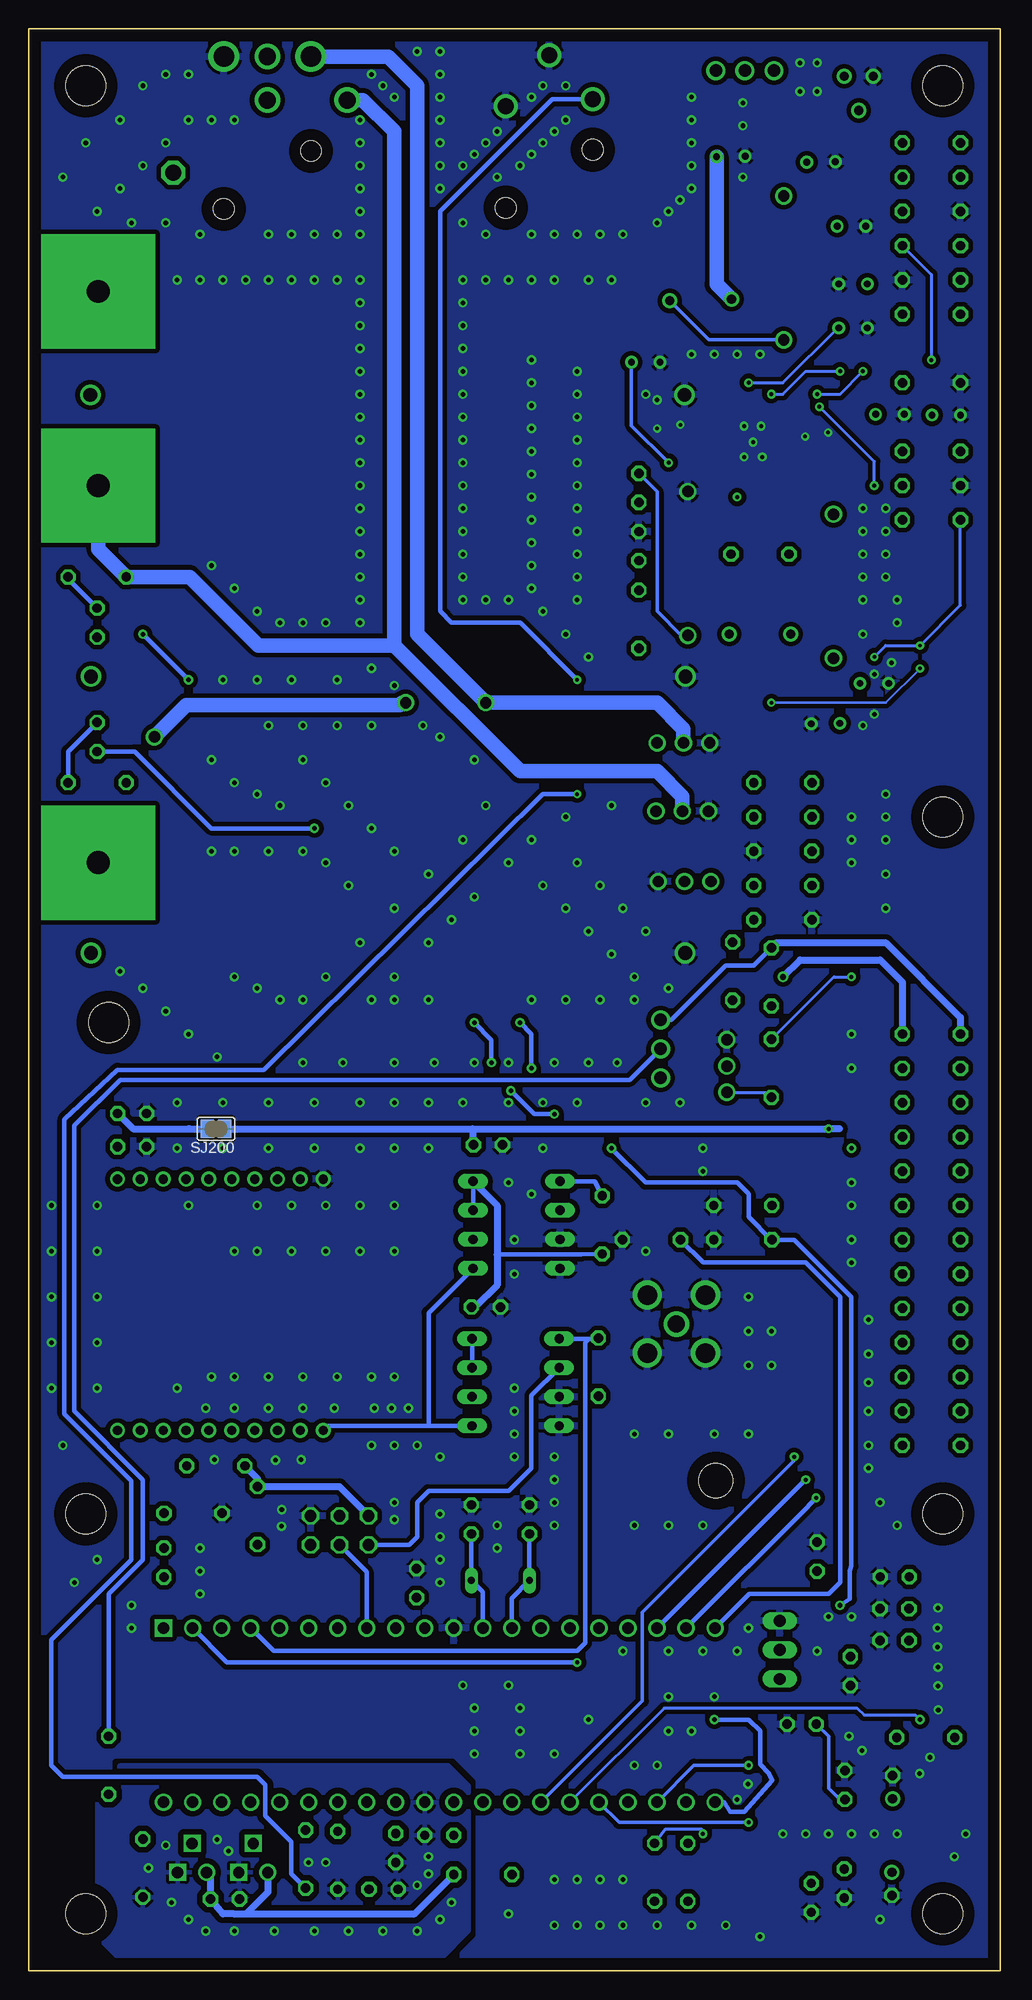
[diagram p8: board, bottom side, seen from below]

Size 85 x 170 mm. Coordinates in mm from the lower left corner, seen from the top.
Outline: 0,0 85,0 85,170 0,170 0,0
Copper layers (1*16): Top 0.035mm / dielectric 1.5mm / Bottom 0.035mm
Design rules "default *": minimum track width 6mil, minimum drill 0.3mm, track to track 6mil, track to pad 6mil, pad to pad 6mil, via to via 6mil, smd to smd 6mil, copper to edge 40mil, drill to drill 6mil, minimum pad ring 10mil, minimum via ring 8mil, stop-mask expansion 4mil, vias tented up to drill 0mil, thermal gap 10mil
Holes 3.5 mm at 80,40 78,83 5,5 80,165 5,165 5,101 5,40 80,5

### Footprints (pad centres in the part's own frame; a part is rotated, then mirrored left to right if it is on the bottom)
LED5MM = drill 0.813 octagon: A -1.27,0; K 1.27,0
2.5MM_AL_CAP = drill 0.6: 1 0.05,1.25; 2 0,-1.25
2.5MM_CAP = drill 0.6: 1 0.75,1.3; 2 3.25,1.3
338TTA035M = drill 1.2: + 11.5,46; - 11.5,-6
C025-025X050 = drill 0.813 octagon: 1 -1.27,0; 2 1.27,0
E2-5 = drill 0.813 pad 1.27: + -1.016,0 | drill 0.813 pad 1.27 octagon: - 1.016,0
1X03 = drill 1.016 long: 1 -2.54,0; 2 0,0; 3 2.54,0
11.6MM_D = drill 1: 1 6.3,0; 2 -6.3,0
DIL8 = drill 0.813 long: 1 -3.81,-3.81; 2 -1.27,-3.81; 3 1.27,-3.81; 4 3.81,-3.81; 5 3.81,3.81; 6 1.27,3.81; 7 -1.27,3.81; 8 -3.81,3.81
FGPMMOPA6H = smd 2 x 1: P$1 -7.5,6.75; P$2 -7.5,5.25; P$3 -7.5,3.75; P$4 -7.5,2.25; P$5 -7.5,0.75; P$6 -7.5,-0.75; P$7 -7.5,-2.25; P$8 -7.5,-3.75; P$9 -7.5,-5.25; P$10 -7.5,-6.75; P$11 7.5,-6.75; P$12 7.5,-5.25; P$13 7.5,-3.75; P$14 7.5,-2.25; P$15 7.5,-0.75; P$16 7.5,0.75; P$17 7.5,2.25; P$18 7.5,3.75; P$19 7.5,5.25; P$20 7.5,6.75 | hole 3: 0.5,0.85
QFN24_0P5_4X4_ASYM_EXP = smd 0.914 x 0.279: 1 -1.84,1.5; 2 -1.84,1; 3 -1.84,0.5; 4 -1.84,0; 5 -1.84,-0.5; 6 -1.84,-1; 7 -1.84,-1.5; 13 1.84,-1.5; 14 1.84,-1; 15 1.84,-0.5; 16 1.84,0; 17 1.84,0.5; 18 1.84,1; 19 1.84,1.5 | smd 0.279 x 0.914: 8 -1,-1.84; 9 -0.5,-1.84; 10 0,-1.84; 11 0.5,-1.84; 12 1,-1.84; 20 1,1.84; 21 0.5,1.84; 22 0,1.84; 23 -0.5,1.84; 24 -1,1.84
LGA14R80P1X6_300X500X100 = smd 1.118 x 0.508: 1 -1.372,2.007; 2 -1.372,1.194; 3 -1.372,0.406; 4 -1.372,-0.406; 5 -1.372,-1.194; 6 -1.372,-2.007; 8 1.372,-2.007; 9 1.372,-1.194; 10 1.372,-0.406; 11 1.372,0.406; 12 1.372,1.194; 13 1.372,2.007 | smd 0.508 x 1.118: 7 0,-1.88; 14 0,1.88
LGA8 = smd 1.9 x 0.6: P$1 -1.5,1.875; P$2 -1.5,0.625; P$3 -1.5,-0.625; P$4 -1.5,-1.875; P$5 1.5,-1.875; P$6 1.5,-0.625; P$7 1.5,0.625; P$8 1.5,1.875
2X03 = drill 1.016 octagon: 1 -2.54,-1.27; 2 -2.54,1.27; 3 0,-1.27; 4 0,1.27; 5 2.54,-1.27; 6 2.54,1.27
5.4MM_L = drill 0.8: 1 0,2.7; 2 0,-2.7
0207/5V = drill 0.813 octagon: 1 -2.54,0; 2 2.54,0
3,81/1,4 = drill 2 pad 10 square: 1 0,0
PMOS = drill 1.1: 1 -2.54,0; 2 0,0; 3 2.54,0
QS = drill 0.61 long: 1 -2.54,0; 2 2.54,0
TO127P254X533-3 = drill 0.991: 1 -2.54,-2.54 | drill 0.991 square: 2 -1.27,0; 3 0,-2.54
PAD.03X.03 = smd 0.762 x 0.762: P$1 0,0
SJ = smd 1.168 x 1.6: 1 -0.762,0; 2 0.762,0
NPNDARL = drill 1: 1 -2.3,0; 2 0,0; 3 2.3,0
LP3 = drill 0.813: 1 -2.54,0; 2 -1.27,3; 3 0,0
TSSOP-20_FE/CB = smd 1.473 x 0.356: 1 -2.819,2.926; 2 -2.819,2.276; 3 -2.819,1.626; 4 -2.819,0.975; 5 -2.819,0.325; 6 -2.819,-0.325; 7 -2.819,-0.975; 8 -2.819,-1.626; 9 -2.819,-2.276; 10 -2.819,-2.926; 11 2.819,-2.926; 12 2.819,-2.276; 13 2.819,-1.626; 14 2.819,-0.975; 15 2.819,-0.325; 16 2.819,0.325; 17 2.819,0.975; 18 2.819,1.626; 19 2.819,2.276; 20 2.819,2.926 | smd 2.743 x 3.861: EPAD 0,0
DIP254P1524X483-40 = drill 0.991 square: 1 -15.24,48.26 | drill 0.991: 2 -15.24,45.72; 3 -15.24,43.18; 4 -15.24,40.64; 5 -15.24,38.1; 6 -15.24,35.56; 7 -15.24,33.02; 8 -15.24,30.48; 9 -15.24,27.94; 10 -15.24,25.4; 11 -15.24,22.86; 12 -15.24,20.32; 13 -15.24,17.78; 14 -15.24,15.24; 15 -15.24,12.7; 16 -15.24,10.16; 17 -15.24,7.62; 18 -15.24,5.08; 19 -15.24,2.54; 20 -15.24,0; 21 0,0; 22 0,2.54; 23 0,5.08; 24 0,7.62; 25 0,10.16; 26 0,12.7; 27 0,15.24; 28 0,17.78; 29 0,20.32; 30 0,22.86; 31 0,25.4; 32 0,27.94; 33 0,30.48; 34 0,33.02; 35 0,35.56; 36 0,38.1; 37 0,40.64; 38 0,43.18; 39 0,45.72; 40 0,48.26
TEST = smd 5.08 x 5.08: P$1 0,0
132134RP = drill 1.5: 0 0,0 | drill 1.7: 1 -2.54,2.54; 2 -2.54,-2.54; 3 2.54,-2.54; 4 2.54,2.54
XBEE-PRO = drill 0.8 pad 1.27: 1 -11,9; 2 -11,7; 3 -11,5; 4 -11,3; 5 -11,1; 6 -11,-1; 7 -11,-3; 8 -11,-5; 9 -11,-7; 10 -11,-9; 11 11,-9; 12 11,-7; 13 11,-5; 14 11,-3; 15 11,-1; 16 11,1; 17 11,3; 18 11,5; 19 11,7; 20 11,9
NC3FAH1 = drill 1.4: 1 -3.81,-12.7; 2 3.81,-13.335; 3 0,-17.15 | hole 1.8: -3.81,-3.81; 3.81,-8.89
NC5FAH = drill 1.5: 1 0,-13.34; 2 0,-17.15; 3 6.98,-13.34 | drill 1.8: 4 3.81,-17.15; 5 -3.81,-17.15 | drill 1.4 octagon: NC -8.25,-6.98 | hole 1.8: -3.81,-3.81; 3.81,-8.89

### Placement (x,y rotation side)
ARMED1  79,118 270 top
ARMED2  79,108 270 top
C1  23.55,158.83 270 top
C2  15.65,158.35 270 top
C3  15,154 180 top
C4  33.6,149.44 270 top
C5  10.86,146.34 0 top
C6  14.85,145.09 180 top
C7  33,142.1 180 top
C8  11.63,137.54 180 top
C9  6.7,137.47 180 top
C10  31.6,129.8 90 top
C11  33.53,124.79 270 top
C12  31.6,124.7 90 top
C13  13,114 180 top
C14  15.26,109.15 90 top
C15  33.55,100.59 270 top
C16  75.94,75.05 180 top
C17  44.8,72.3 180 top
C18  75.94,72.14 180 top
C19  44.98,58.1 180 top
C20  41.17,39.52 90 top
C21  46.25,39.52 90 top
C22  16.01,36.26 270 top
C23  9.2,34.48 0 top
C24  51.05,33.94 90 top
C25  9.23,31.7 0 top
C26  9.23,28.92 0 top
C27  13.09,26.24 270 top
C28  17.36,21.6 0 top
C29  13.57,16.28 90 top
C30  9.39,16.08 90 top
C31  49.06,11.88 180 top
C32  52.87,10.76 270 top
C33  13.62,7.65 270 top
C34  9.46,7.63 270 top
C35  53.94,7.15 180 top
C36  16.52,6.4 270 top
C37  67.81,6.29 0 top
CONSOLE  19.27,28.1 90 top
D1  18.92,149.05 90 top
D2  27.31,123.18 270 top
D3  14.57,121.19 90 top
DEBUG  73.16,35.74 90 top
IC1  42.3,65.3 270 top
IC2  42.38,51.52 270 top
IC3  25.72,42.43 90 top
IC4  9,25 90 top
IC5  17.5,17 0 top
IC6  20.6,7.1 0 top
ICSP  57.78,38.56 0 top
L1  26.19,146.24 88.5 top
L2  21,117 270 top
L3  45.25,8.44 0 top
PAD1  78.9,147 0 top
PAD2  78.9,130 0 top
PAD3  78.9,97 0 top
Q1  22.32,166.32 0 top
Q2  29.7,80.7 90 top
Q3  43.71,34.17 180 top
Q4  66.61,11.16 0 top
Q5  71.96,11.16 0 top
R1  6,160 0 top
R2  6,157 0 top
R3  6,154 180 top
R4  6,151 180 top
R5  6,148 0 top
R6  6,145 0 top
R7  6,139 0 top
R8  6,133 0 top
R9  6,130 0 top
R10  6,127 180 top
R11  21,124 180 top
R12  79,122 180 top
R13  31.6,118.3 270 top
R14  19,104 0 top
R15  79,104 0 top
R16  19,101 0 top
R17  19,98 180 top
R18  19,95 0 top
R19  19,92 0 top
R20  23.4,87.5 90 top
R21  20,87 270 top
R22  6,82 180 top
R23  6,79 180 top
R24  20,79 270 top
R25  6,76 180 top
R26  6,73 180 top
R27  6,70 180 top
R28  6,67 180 top
R29  22.5,67 180 top
R30  34.8,65.3 270 top
R31  6,64 180 top
R32  22.5,64 0 top
R33  30.5,64 0 top
R34  6,61 180 top
R35  6,58 180 top
R36  6,55 180 top
R37  35.14,52.85 270 top
R38  6,52 180 top
R39  6,49 180 top
R40  6,46 180 top
R41  68.61,44.2 180 top
R42  70.61,40.06 180 top
R43  64.97,39.86 90 top
R44  6.5,20.43 0 top
R45  78,18 270 top
R46  60.76,9.79 270 top
R47  57.95,9.69 90 top
R48  75,9 270 top
R49  27.31,8.64 270 top
R50  30.22,8.64 270 top
SCL  23.5,11.7 0 top
SDA  25,11.7 0 top
SJ1  49.6,43 0 top
SJ2  12.7,37.3 0 top
SJ3  4,35 270 top
SJ4  4.6,15 0 top
SJ5  7,11 270 top
SJ200  68.6,73.7 180 bottom
T1  27.7,107.47 0 top
T2  27.8,101.51 0 top
T3  27.6,95.35 180 top
T4  23.9,79.2 270 top
U1  11.09,165.83 180 top
U2  21.59,133.81 0 top
U3  24.93,14.77 270 top
U$1  5,121.8 0 top
U$2  4.8,110.7 0 top
U$3  4.9,92.9 0 top
U$4  5,87 0 top
U$5  22,71 0 top
U$6  29.7,70.8 0 top
U$7  79.1,27.2 90 top
X1  28.31,56.62 0 top
XB1  68.22,58.3 270 top
XLR1  39.44,150.5 180 top
XLR2  64.11,150.4 180 top

### Tracks (layer width: path | path; a pad name or v marks a point on that pad's centre or on a via)
12V_ENABLE  (via drill 0.35)
  Top 0.254: v15.8,136.9 16.61,136.09 U2.2 | R24.1 22,79.54 U$5.P$1 | v11,130 11,117.5 8.4,114.9 8.4,110.6 10.82,107.58 10.82,89.18 v13,87
  Top 0.406: v18,45 18,67 | 18,67 18,79.54 R24.1 | R29.2 18,67
  Bottom 0.254: R24.1 14.54,87 v13,87 | v11,130 11,132.1 v15.8,136.9
  Bottom 0.305: U3.27 31.3,23.64 31.3,31.4 18,44.7 v18,45
+12.0  (via drill 0.35, 0.5)
  Top 0.254: C3.1 12.55,151 R4.1 | v6,141 3,141 3,140.77 1.22,138.99 1.22,113.28 U$2.P$1
  Top 0.61: R22.1 R23.1 R25.1 R26.1 R27.1 R28.1 R31.1 R34.1 R35.1 R36.1 R38.1 R39.1 R40.1 | D1.1 16.27,152.7 C3.1 14.25,155.64 C2.1 18.7,158.3 22,155 25,155 31.14,148.86 32.36,148.86 32.86,148.36 32.86,147.14 39,141 39,97 29,87 v19,87
  Bottom 0.254: R4.1 6,148.46 v6,141
  Bottom 0.61: v19,87 17.5,88.5 10.5,88.5 8.54,86.54 R22.1
A_GND  (via drill 0.4)
  other vias: 57,3.5 54,3.5 51,3.5 49,4.5 51,7.5 50,8.5 59,9.5 60.5,9.5 60,3.5 63.5,3.5 67,3.5 69.5,3.5 71,4.5 72.5,6 74.5,9 73,11 68.5,11.5 67.5,10.5 50,10 48,6
  pour Bottom (isolate 0.508): 49,1 46.5,3.5 46.5,16.2 48.3,18 49,18 77,18 79,16 79,3 77,1
  pour Bottom (isolate 0.61): 49,1 46.5,3.5 46.5,16.2 48.3,18 77,18 79,16 79,3 77,1
  pour Top (isolate 0.61): 49,1 46.5,3.5 46.5,16.2 48.3,18 77,18 79,16 79,3 77,1
ACCEL_INT  (via drill 0.35)
  Top 0.305: v22,13 20.01,14.99 IC5.8
  Bottom 0.305: U3.25 33.32,13 v22,13
ALT_INT
  Top 0.305: IC6.P$6 25.48,6.47 27,8 31,8 32.55,9.55 U3.24
AREF
  Top 0.61: C32.1 U3.32
AVCC
  Top 0.61: L3.2 C31.2 U3.30
  Bottom 0.61: L3.2 51.25,4.97 66,4.97 | 66,4.97 67,4.97 67.03,5 68,5 68,5.01 C37.2 69.08,8.28 Q5.1 | Q4.1 64.07,6.9 66,4.97
BAT+  (via drill 0.3)
  Top 0.2: v37,113 32,113 30,111 v20,111 | v7,114 5,116 U$1.P$1
  Top 0.254: R2.1 R1.1
  Top 0.406: Q1.3 23.18,168 11,168 9,166 9,163 6,160 R1.1 | v37,103 v37,113
  Top 1.27: XLR1.2 33.15,166.32 Q1.3
  Bottom 0.2: v20,111 10,111 v7,114
  Bottom 0.406: R46.2 62,8.49 62,11.3 64.3,13.6 64.3,16.3 65,17 82,17 83,18 83,29 76,36 76,42.91 81.86,48.77 81.86,74.53 77.23,78.86 64.44,78.86 40,103 v37,103 | v37,113 42,118 48,118 49,119 49,154 39.16,163.84 XLR1.2
BAT_REF
  Top 0.61: R46.1 58.05,12.33 R47.2 55.44,12.23 55.21,12 | C35.1 55.21,12 | 55.21,12 55.21,14.57 U3.33
CAP_DISCHARGE  (via drill 0.35)
  Top 0.406: R18.1 14,92.54 14,90 17,87 v17,43
  Bottom 0.406: U3.18 18.02,42 | 18.02,42 18,42 | 18.02,42 17.02,43 v17,43
CAP_REF
  Top 0.406: U3.40 73.19,13.35 R48.1 75,12.46 R45.2 81,18.46 81,25.3 U$7.P$1
DEBUG_LED
  Top 0.406: U3.1 73.16,30.04 DEBUG.A
EEPROM2_CS  (via drill 0.35)
  Top 0.305: 36.3,27.7 36.3,46.2 36.3,63.42
  Top 0.406: v37,27 36.3,27.7 | 36.3,63.42 36.42,63.54 36.42,68 | 36.42,68 36.42,68.02 | 36.42,68 37.53,69.11 IC1.1
  Bottom 0.406: IC1.1 35.47,69.11 R30.1 | U3.2 67.64,27 v37,27
EEPROM_CS
  Bottom 0.406: IC2.1 36,55.33 | 36,55.33 35.28,55.33 R37.1 | U3.4 63.56,28 37,28 36.3,28.7 36.3,55.03 36,55.33
EMATCH_SENSE_1  (via drill 0.4)
  Top 0.406: ARMED1.K 78.73,117 v75,117 | v71,113 43.76,85.76 43.69,85.76 42,84.07 v42,83 | v41,79 41,75 39,73 36.93,73 36.24,72.31 36.24,72.28 R33.1
  Bottom 0.406: U3.20 21.94,33 15,33 14,34 14,59 17,62 25.96,62 R33.1 | v75,117 v71,113 | v42,83 41,82 v41,79
EMATCH_SENSE_2  (via drill 0.4)
  Top 0.406: v60,100 55,95 55,91.93 47.31,84.24 47.24,84.24 v46,83 | v44.5,79.5 43,78 v42.8,77.04 | v39,75 37,75 v34,72 | v25,22 23,24 18,24 15,27 15,29 14,30 v14,32
  Bottom 0.406: ARMED2.K 75.73,106.73 69,100 v60,100 | v46,83 44.5,81.5 v44.5,79.5 | v42.8,77.04 40.76,75 v39,75 | v34,72 31,69 23,69 22,68 22,66 20,64 R32.1 18,64 13,59 13,35.44 13.14,35 13.14,32.56 v14,32 | U3.21 24.14,14.77 23.61,13.94 22.39,13.94 19.94,16.69 20.24,17.31 21,18.07 21,21 22,22 v25,22
FB1  (via drill 0.35)
  Top 0.254: R5.1 R4.2 | U2.1 17.51,138 v16,138
  Top 0.305: v12,140 10,140 8,142 3,142 1.25,143.75 1.25,147 2.25,148 R5.1
  Bottom 0.254: v16,138 14,138 v12,140
GND  (via drill 0.3, 0.35, 0.4)
  Top 0.152: IC4.1 5.71,23.16 v5.4,22.85
  Top 0.2: IC4.7 IC4.6 IC4.5 9.5,24.5 9,25
  Top 0.254: v20.9,135.2 20.9,134.78 U2.4 17.55,134.78 v17.05,134.29 | U2.EPAD 21.59,134.13 U2.5 17.2,134.13 v17.05,134.29 | 21.6,134.78 v21.6,133.8 | v17.05,134.29 15.4,134.29 v15.04,134.65 | 10,25 IC4.10 IC4.9 | 10,25 9,25 IC4.22 5.5,25 v5.44,24.94 5.88,24.5 IC4.23 | 10,25 IC4.14 IC4.13 | IC5.2 14.22,18.19 C29.2 14.53,16.59 IC5.4 | IC5.12 20.7,18.19 | 20.7,18.19 20.81,18.19 | 22,17 v22.05,16.35 20.7,16 20.7,18.19 | IC6.P$3 17.87,6.47 C36.2 | IC4.24 6.55,24 v5.4,22.85 | IC4.21 6.51,25.5 v5.43,26.58 6.01,26 IC4.20 7.16,26.5 IC4.19
  Top 0.305: v21.6,133.8 22.59,134.78 U2.17 26.79,134.78 27.32,135.32 v27.97,135.32 29.68,135.32 v30,135
  other vias: 22.4,135.2 22.4,132.5 20.8,132.5 61.15,44.75 63.4,44.71 62.85,40.37 62.87,38.92 11,12 13,12 15,12 17,12 19,12 23,15 5.43,31.77 5.46,28.36 5.46,30.02 6.13,18.7 7.03,17.27 12.08,19.29 13.22,20.54 13,31 15,31 16,28 22,30 23,28 26,28 29,28 33,28 27,21 29,21 30,18 32,18 36,22 43,25 42,23 42,19 39,19 70,37 70,35 70,33 46,23 47,25 46,19 46,21 79,36 81,34 76,32 76,30 42.5,51 42.5,49 42.5,47 42.5,45 39,45 39,43 39,41 39,39 44,39 44,37 49,40 49,38 53,41 53,39.5 49,36 49,34 22,47 25,47 29,47 32,47 32,39 29,39 26,39 22,53 20,53 22,56 20,56 22,59 31,63 11.5,57 11.5,54 11.5,51.5 11.5,49 11.5,46 11.5,44 10.5,41 9,39 13,62 13,64 13,67 13,69 49,45 51,46 53,46 55,46 68.75,44.75 69.5,49.25 67,49.25 64,49.25 61,49.25 58.25,49.25 54.75,49.25 53.25,49.25 51.75,49.25 53,52 55,52 58,52 61,52 64,52 67,52 69,52 72,51 39,8 37,8 35,8 33,8 43,5 39,4 37,4 35,4 33,4 30,4 27,4 24,4 21,3 43,69 41,68 42.5,64 42.5,61 53,67 56,67 59,67 62,67 65,67 71,67 67,63 65,63 59,63 53,63 62,63 56,63 79,67 83,67 83,63 79,63 79,59 83,59 83,55 79,55 83,51 79,51 82,46 26,72 26,70 28,76 31,76 37,76 40,76 40,72 39,79.5 36,79.5 33.5,79.5 29,86 32,85 35,85 38,85 41,85 43,79.5 43,76 47,76 46,79.5 50,85 49.5,79.5 50,76 50,72 53,72 53,76 53,79.5 53,85 55,85 57.5,79.5 56,76 56,72 61,85 63,85 61,79.5 68.5,80 65,86 67,87 71,82 73,84 75,86 77,87.5 59,87 53,87 56,90 53,93 50,90 48,92 50,96 47,99 46,94 43,97 45,102 41,99 38,101 34,102 46,106 49,108 50.5,109 53,112.5 55,114 56,118 56,120 56,122 56,124 56,126 56,130 56,128 36,115 38,117 40,119 43,120 45,120 47,120 47,122 47,124 47,126 47,128 47,130 47,132 56,132 56,134 56,136 56,138 56,140 56,142 56,144 56,146 56,148 47,148 47,146 47,144 47,142 47,140 47,138 47,136 47,134 34,148 36,148 39,148 41,148 43,148 45,148 58,148 60,148 72,72 72,76 68,76 68,72 64,72 60,72 60,76 64,76 62,148 64,148 66,148 68,148 70,148 72,148 71,166 70,152 64,152 62,152 60,152 58,152 56,152 56,154 56,156 56,158 56,160 56,162 67,162 69,162 71,162 73,166 75,165 77,162 80,160 82,157 79,154 77,156 75,158 73,160 73,153 76,153 53,164 54,165 55,166 51,168 49,168 49,166 49,164 49,162 49,160 49,158 49,156 47,153 45,152 41,152 39,152 37,152 35,152 33,152 30,153 29,154 28,155 27,156 16,167 17.5,167 17.5,164.5 16,164.5 22.5,163.5 22.5,161.5 27,164 27,162 27,160 27,158 22.5,157 25,24 29,24 42,21 21,141.5 23,141.5 25,141.5 27,141.5 31,138 30,137.5 10,103 10,101 13,101 13,99 10,99 10,96 13,97 10,93 13,82 13,79 12,117 9,118 9,120 12,120 12,122 10,122 12,124 10,124 12,126 10,126 10,128 12,128 9.5,114.5 11,113.5 11,110 12,109 3,12 4,10 9,12 10.5,4.5 41,121 41,123 41,125 41,127 41,129 41,131 41,141 41,139 41,137 41,135 41,133 37,120 37,122 37,124 37,126 37,128 37,130 37,140 37,138 37,136 37,134 37,132 58,113 62,113 65,113 68,113 64,109 58,109 55,109 59,118 61,118 63,118 65,119 67,121 69,123 38,165 40,165 41,164 44,161 45,160 46,159 47,158 42,158 44,157 41,159 40,160 39,161 38,162 61,109 61,106 59,104 57,102 55,100 53,98 57,95 59,97 61,98 64,98 67,98 69,98 69,106 67,104 65,103 63,102 37,97 40,95 38,93 36,91 34,89 32,87 35,95 33,93 31,91
  pour Top (isolate 0.406, rank 2): 0,0 85,0 85,170 0,170
  pour Bottom (isolate 0.406, rank 2): 0,0 85,0 85,170 0,170
GYRO_INT  (via drill 0.4)
  Top 0.254: v7,22 8,22 8.5,22.5 IC4.3
  Bottom 0.254: U3.26 29.4,23 12.5,23 11.9,22.4 7.4,22.4 v7,22
MAIN_TRIGGER  (via drill 0.35)
  Top 0.406: R14.1 R16.1 | R16.1 R17.2 13,94.54 13,90 16.1,86.9 v16.1,41.4 | R16.1 16,101
  Bottom 0.406: U3.19 16.8,40.68 16.8,40.7 v16.1,41.4
MISO
  Top 0.406: ICSP.1 57.95,34.58 U3.7 | XB1.4 67.32,65.4 41,65.4 | IC1.2 39.66,65.4 41,65.4 | IC2.2 41,55.22 41,65.4
  Bottom 0.406: ICSP.1 51.71,37.29 51,38 51,41 50,42 43,42 41,44 41,50.36 IC2.2
MOSI
  Top 0.406: ICSP.4 57.8,39.8 | 57.8,39.8 59,38.61 59,31.5 U3.6 | XB1.11 59.22,41.22 57.8,39.8
  Bottom 0.406: IC2.5 50,47.71 | 50,47.71 58.81,47.71 XB1.11 | IC1.5 50,57.6 50,47.71
N$1
  Top 0.254: C27.1 12.9,27.7 9,27.7 IC4.16
N$2
  Top 0.254: IC4.4 9,20.47 R44.2
N$3
  Top 0.305: C36.1 16.58,7.72 IC6.P$2
N$4
  Top 1.016: IC3.P$11 32.47,51.33 31.9,51.9 28.7,51.9 28.3,52.3 28.31,52.31 X1.0
N$5
  Top 0.254: U2.7 14.29,132.84 C8.1
N$6
  Top 0.254: R7.2 11,139 12,138 12,136.11 14.62,133.49 U2.6
N$7
  Top 0.254: U2.8 9.36,132.18 R8.2
N$8
  Top 0.305: U2.16 27,134.13 27.38,134.13 32.13,134.13 32.75,134.75 33,135 34,136 34,144 31.83,146.17 L1.2
  Bottom 0.305: L1.2 25.47,142.75 D1.2
N$9
  Top 0.254: R6.2 11.19,147.65 C5.1
N$10
  Top 0.254: R8.1 5.95,135.49 C9.1
N$11  (via drill 0.35)
  Top 0.305: U2.20 23.14,138 v20,138 | v14,140 13,141 10,141 8,143 5.46,143 R6.1
  Bottom 0.254: v20,138 19,138 17,140 v14,140
N$12  (via drill 0.35)
  Top 0.305: U2.19 25.59,136.09 26.1,136.6 26.1,136.9 24,139 v22,139
  Bottom 0.254: v22,139 19,139 14.21,143.79 C6.1
N$13
  Top 0.254: U2.15 24.44,133.52 | 30.48,116.88 R13.2
  Top 0.305: 24.44,133.52 30,133.52 31.6,131.92 C10.2 | 30.48,116.88 D2.1 27.2,117 L2.1
  Bottom 0.305: C10.2 30,129.47 30,119 27.88,116.88 D2.1
N$15
  Top 0.254: U2.9 10.07,131.53 R9.2 R10.1
N$16  (via drill 0.35)
  Top 0.305: U2.13 25.52,132.18 26,131.7 26,130.5 24.5,129 v23,129 | R11.2 18.46,124.46 v23,129 | D3.1 16.08,129 v23,129
N$30
  Top 0.61: R22.2 R23.2 R25.2 R26.2 R27.2 R28.2 R31.2 R34.2 R35.2 R36.2 R38.2 R39.2 R40.2
  Bottom 0.406: R21.1 21.54,88 24,88 28.76,83.24 Q2.3
  Bottom 0.61: R21.1 19.54,90 10,90 3.46,83.46 R22.2
N$31
  Top 0.406: Q2.1 24.94,78.16 24.05,79.05 | 24.05,79.05 T4.2 | R21.2 22,82.46 22,81 23.95,79.05 24.05,79.05
N$34
  Top 0.406: T3.2 27.6,94.24 R20.2
  Top 0.61: T3.2 27.6,95.14
N$35
  Bottom 0.254: T4.3 20,76.9 R24.2
N$67
  Top 0.254: C12.1 R13.1
N$69
  Top 0.406: Q1.1 19.29,165.83 U1.1 8.54,160.74 R1.2
N$70
  Top 0.406: U1.2 12.36,160.82 R2.2 R3.1
N$71
  Top 0.406: DEBUG.K R42.1
N$75
  Top 0.305: C10.1 30.07,127 26.54,127 R11.1
N$77  (via drill 1)
  Top 1.27: v74,108 74,106.46 R15.1 76.46,99.44 PAD3.1 | v45,111 v52,111
  Bottom 1.27: XLR2.4 53.55,167.55 51,165 51,117 v45,111 30,111 27.7,108.7 T1.2 | v52,111 52.32,111 52.51,110.81 71.19,110.81 v74,108
N$78
  Bottom 1.27: XLR2.3 55.74,163.74 53,161 53,116 | T2.2 27.8,102.8 30,105 42,105 53,116 | 53,116 64.9,116 70.9,122 R12.2 78.9,124.44 PAD2.1
N$79
  Top 0.406: R16.2 23.54,99 28,99 30.1,101.1 T2.3
N$80
  Top 0.406: R14.2 22.54,105 28,105 30,107 T1.3
N$81
  Top 0.254: Q2.2 33,77.4 33,73.1 U$6.P$1
  Top 0.406: R20.1 27.6,80.76 29.7,80.76 | 33.54,77.22 30,80.76
  Top 0.61: Q2.2 29.7,80.76 30,80.76 66.76,80.76 75.09,89.09
  Top 1.27: XLR2.2 XLR2.1 72.26,163.74 81,155 81,149.1 PAD1.1 79.6,146.3 C4.+ 74.94,137.94 71,134 71,117 74.71,113.29 C11.+ 74.29,113.29 71,110 71,93.18 75.09,89.09 C15.+
  Bottom 0.406: R45.1 78,33 75,36 75,43 81,49 81,74 77,78 32.4,78 Q2.2
N$82
  Top 0.406: R19.2 R18.2 21.89,95.35 T3.3
N$84
  Bottom 0.406: R15.2 81.54,106.73 ARMED2.A
N$85
  Bottom 0.406: R12.1 81.54,121.81 ARMED1.A
N$109  (via drill 0.4)
  other vias: 13,72
PWR_JUNC  (via drill 0.35)
  Top 0.305: U2.3 15.56,135.44 14,137 14,138 16,140 28,140 29,139 30.45,139 C7.1 33,140.05 33,137 32.25,136.25 26.75,136.25 25.94,135.44 U2.18 | U2.14 28.16,132.84 v29,132
  Top 0.61: L1.1 25.8,144 29.05,144 C7.1
  Top 1.27: Q1.2 24.8,163.84 C1.1
  Bottom 0.305: v29,132 32.25,135.25 C7.1
  Bottom 1.27: C1.1 24.8,147.62 L1.1
RADIO_CS
  Top 0.406: XB1.17 71.22,44.26 R41.1 69.96,43 68,43 66.4,41.4 66.4,34.3 65.8,33.7 63.6,33.7 63.03,33.13 U3.5
RADIO_INT
  Top 0.406: XB1.19 73,45.08 73,43 68.11,38.11 U3.3
RESET
  Top 0.406: R43.1 64.94,37.29 61.8,37.29 | 61.8,37.29 ICSP.5 | 61.8,37.29 61.8,28.8 61,28 54.88,28 54,28 52.87,29.13 U3.9
RXD0
  Top 0.406: U3.14 40,29.84 40,27 38,25 19.83,25 CONSOLE.1
RXD1
  Top 0.406: IC3.P$9 31,34.96 31,36 32,37 34,37 35.09,35.91 U3.16
SCK
  Top 0.406: ICSP.3 56.5,38.57 56.5,50.25 | XB1.18 70.27,50.25 56.5,50.25 | 56.5,50.25 50,50.25 | 50,50.25 IC2.6 | IC1.6 50,60.14 50,50.25
  Bottom 0.406: 46.25,50.25 IC2.6 | ICSP.3 55.41,34.92 U3.8
SCL
  Top 0.254: 17.5,20.25 17.3,20.45 17.3,22.4 16.7,23 13,23 11.8,24.2 11.8,25.11 11.41,25.5 IC4.11 | 17.5,20.25 IC5.14 | 17.5,20.25 21.75,20.25 22.43,19.57
  Top 0.305: U3.22 27.47,11.34 R49.1 27.18,11.18 24.98,8.97 IC6.P$8 | U3.22 25.7,13 24.8,13 SCL.P$1 | U3.22 27.23,14.77 22.43,19.57 | IC5.14
SDA  (via drill 0.35)
  Top 0.254: v26,12 25.7,11.7 SDA.P$1 | IC4.12 15,26 18,23 21.78,23 U3.23 | 19.89,19.01 20.99,19.01 v22,18
  Top 0.305: U3.23 30.01,11.39 R50.1 29.04,10 27,10 24.73,7.72 IC6.P$7 | IC5.13 19.89,19.01
  Bottom 0.254: R50.1 29.28,12.42 26.12,12.42 v26,12
  Bottom 0.305: U3.23 26.78,18 v22,18
TEMP
  Top 0.406: U3.39 70.69,14.73
  Top 0.61: U3.39 70.65,11.2 Q5.2
TEMP2
  Top 0.61: U3.38 68.11,13.93 Q4.2
TXD0
  Top 0.406: U3.15 38,29.64 38,26.8 37.1,25.9 21.47,25.9 CONSOLE.2
TXD1
  Top 0.406: IC3.P$10 32.55,34.85 U3.17
VCC  (via drill 0.3, 0.35)
  Top 0.254: D3.2 11.11,114.89 v11,115 | 15,83 5.1,92.9 U$3.P$1
  Top 0.406: R30.2 34,62.56 34,51 34.79,50.21 R37.2
  Top 0.61: C17.1 46.07,69.15 IC1.8 | 45.9,58.1 C19.1 46.19,58.05 IC2.8 45.33,55.33 44,54 44,46 47,43 SJ1.1 | 4.34,36.11 SJ3.1 | SJ3.1 2.66,35.76 2.2,35.3 2.2,15 | 2.2,15 SJ4.1 | 6.62,12.14 SJ5.1 5.44,11.76 2.2,15 | SJ3.1 8.46,35.76 10,37.3 | 10,37.3 15,42.3 v15,73.7 15,83 15,86.4 12,89.4 12,102 13.91,103.91 13.91,109.09 C14.1 12.25,110.96 C13.1 14.44,114.89 D3.2 16.68,117 L2.2 | SJ2.1 10,37.3
  Bottom 0.254: v11,115 10,116 v7,116 3.46,119.54 R10.2
  Bottom 0.406: IC1.8 IC1.7 | IC2.8 IC2.7 | R30.2 36.66,62.7 44,62.7
  Bottom 0.61: C17.1 46.07,73.6 46.17,73.7 | SJ200.1 46.17,73.7 | 46.17,73.7 v15,73.7 14.04,73.7 | IC1.8 44,67 44,62.7 44,60 45.9,58.1 C19.1
VCC_ACCEL
  Top 0.254: IC5.7 17.37,14.99
  Top 0.305: 17.37,14.99 IC5.6 16.11,15.01 C29.1 | IC5.1 16.13,21.55 C28.1
  Top 0.61: 16.09,19.05 IC5.1 | C29.1 13.52,15.06 C30.+ 9.33,15 SJ4.2
  Bottom 0.305: C29.1 14.01,15.01 15,16 15,20.51 C28.1
VCC_ALT
  Top 0.254: C33.1 12,7.3 12,4 13,3 17,3 17,3.12 IC6.P$4
  Top 0.305: IC6.P$1 13.67,8.97 C33.1 13.77,8.77 | 18.27,5.22 IC6.P$4
  Top 0.61: 13.77,8.77 13.64,8.64 C34.+ 8.6,8.64 SJ5.2
VCC_GPS
  Top 0.61: IC3.P$1 18.91,34.99 C22.2 15.77,34.99 SJ2.2
VCC_GYRO
  Top 0.254: C26.1 8,28.88 IC4.18 IC4.17 8.5,25.96 8.71,25.75 9.21,25.75 9.5,26.04 IC4.15
  Top 0.305: SJ3.2 4,21.47 R44.1
  Top 0.61: C26.1 C25.1 7.96,34.46 C23.1 7.69,34.24 SJ3.2
VCC_MCU
  Top 0.508: 44,23.68 44,9.73
  Top 0.61: 44,23.68 U3.10 51.05,30.73 C24.1 51.67,32.67 53,34 53,37.59 ICSP.2 55.24,40.76 53,43 SJ1.2 | 44,9.73 L3.1 40.37,6.1 R50.2 R49.2
  Bottom 0.61: ICSP.2 57.81,42.4 R43.2 64.97,43.09 R41.2
VCC_XB
  Top 0.61: C16.1 C18.1 77.21,70.31 XB1.1
  Bottom 0.61: C16.1 75.86,73.7 71,73.7 70.9,73.7 SJ200.2
XTAL1
  Bottom 0.406: U3.13 42.71,32.63 Q3.2 C20.1
XTAL2
  Bottom 0.406: U3.12 45.25,33.17 Q3.1 C21.1

### Text on the board
tPlace: REV 2.0 | SAMUEL DEWAN | COLIN ANDERSEN | ARMED 1 | CONNECT TO ARM | ARMED 2 | ARMED | CONNECT TO ARM | GND
tNames: EEPROM 2 | GPS Antenna | EEPROM 1 | +3.3V | MOSI | GND | SCK | RST | MISO | GND | TXD | RXD | Gyro | Accel | SCL | SDA | Alt
201bmp: C:/Users/Colin/Desktop/inspacetest.bmp
205bmp: 2018 HARDWARE & SOFTWARE TEAM: / ANDREW DION APEKSHA BUDHKAR COLIN ANDERSEN CAMERON SOMERS / FEDERICO NARANJO JOREN RAYMOND MICHAEL AZIZ MICHAEL WIEBE / RAFI KHAN SAMUEL DEWAN TADHG MCDONALD-JENSEN ZHONGTIAN XIA